# EasyEDA Pro project devboard.epro, board RCKid
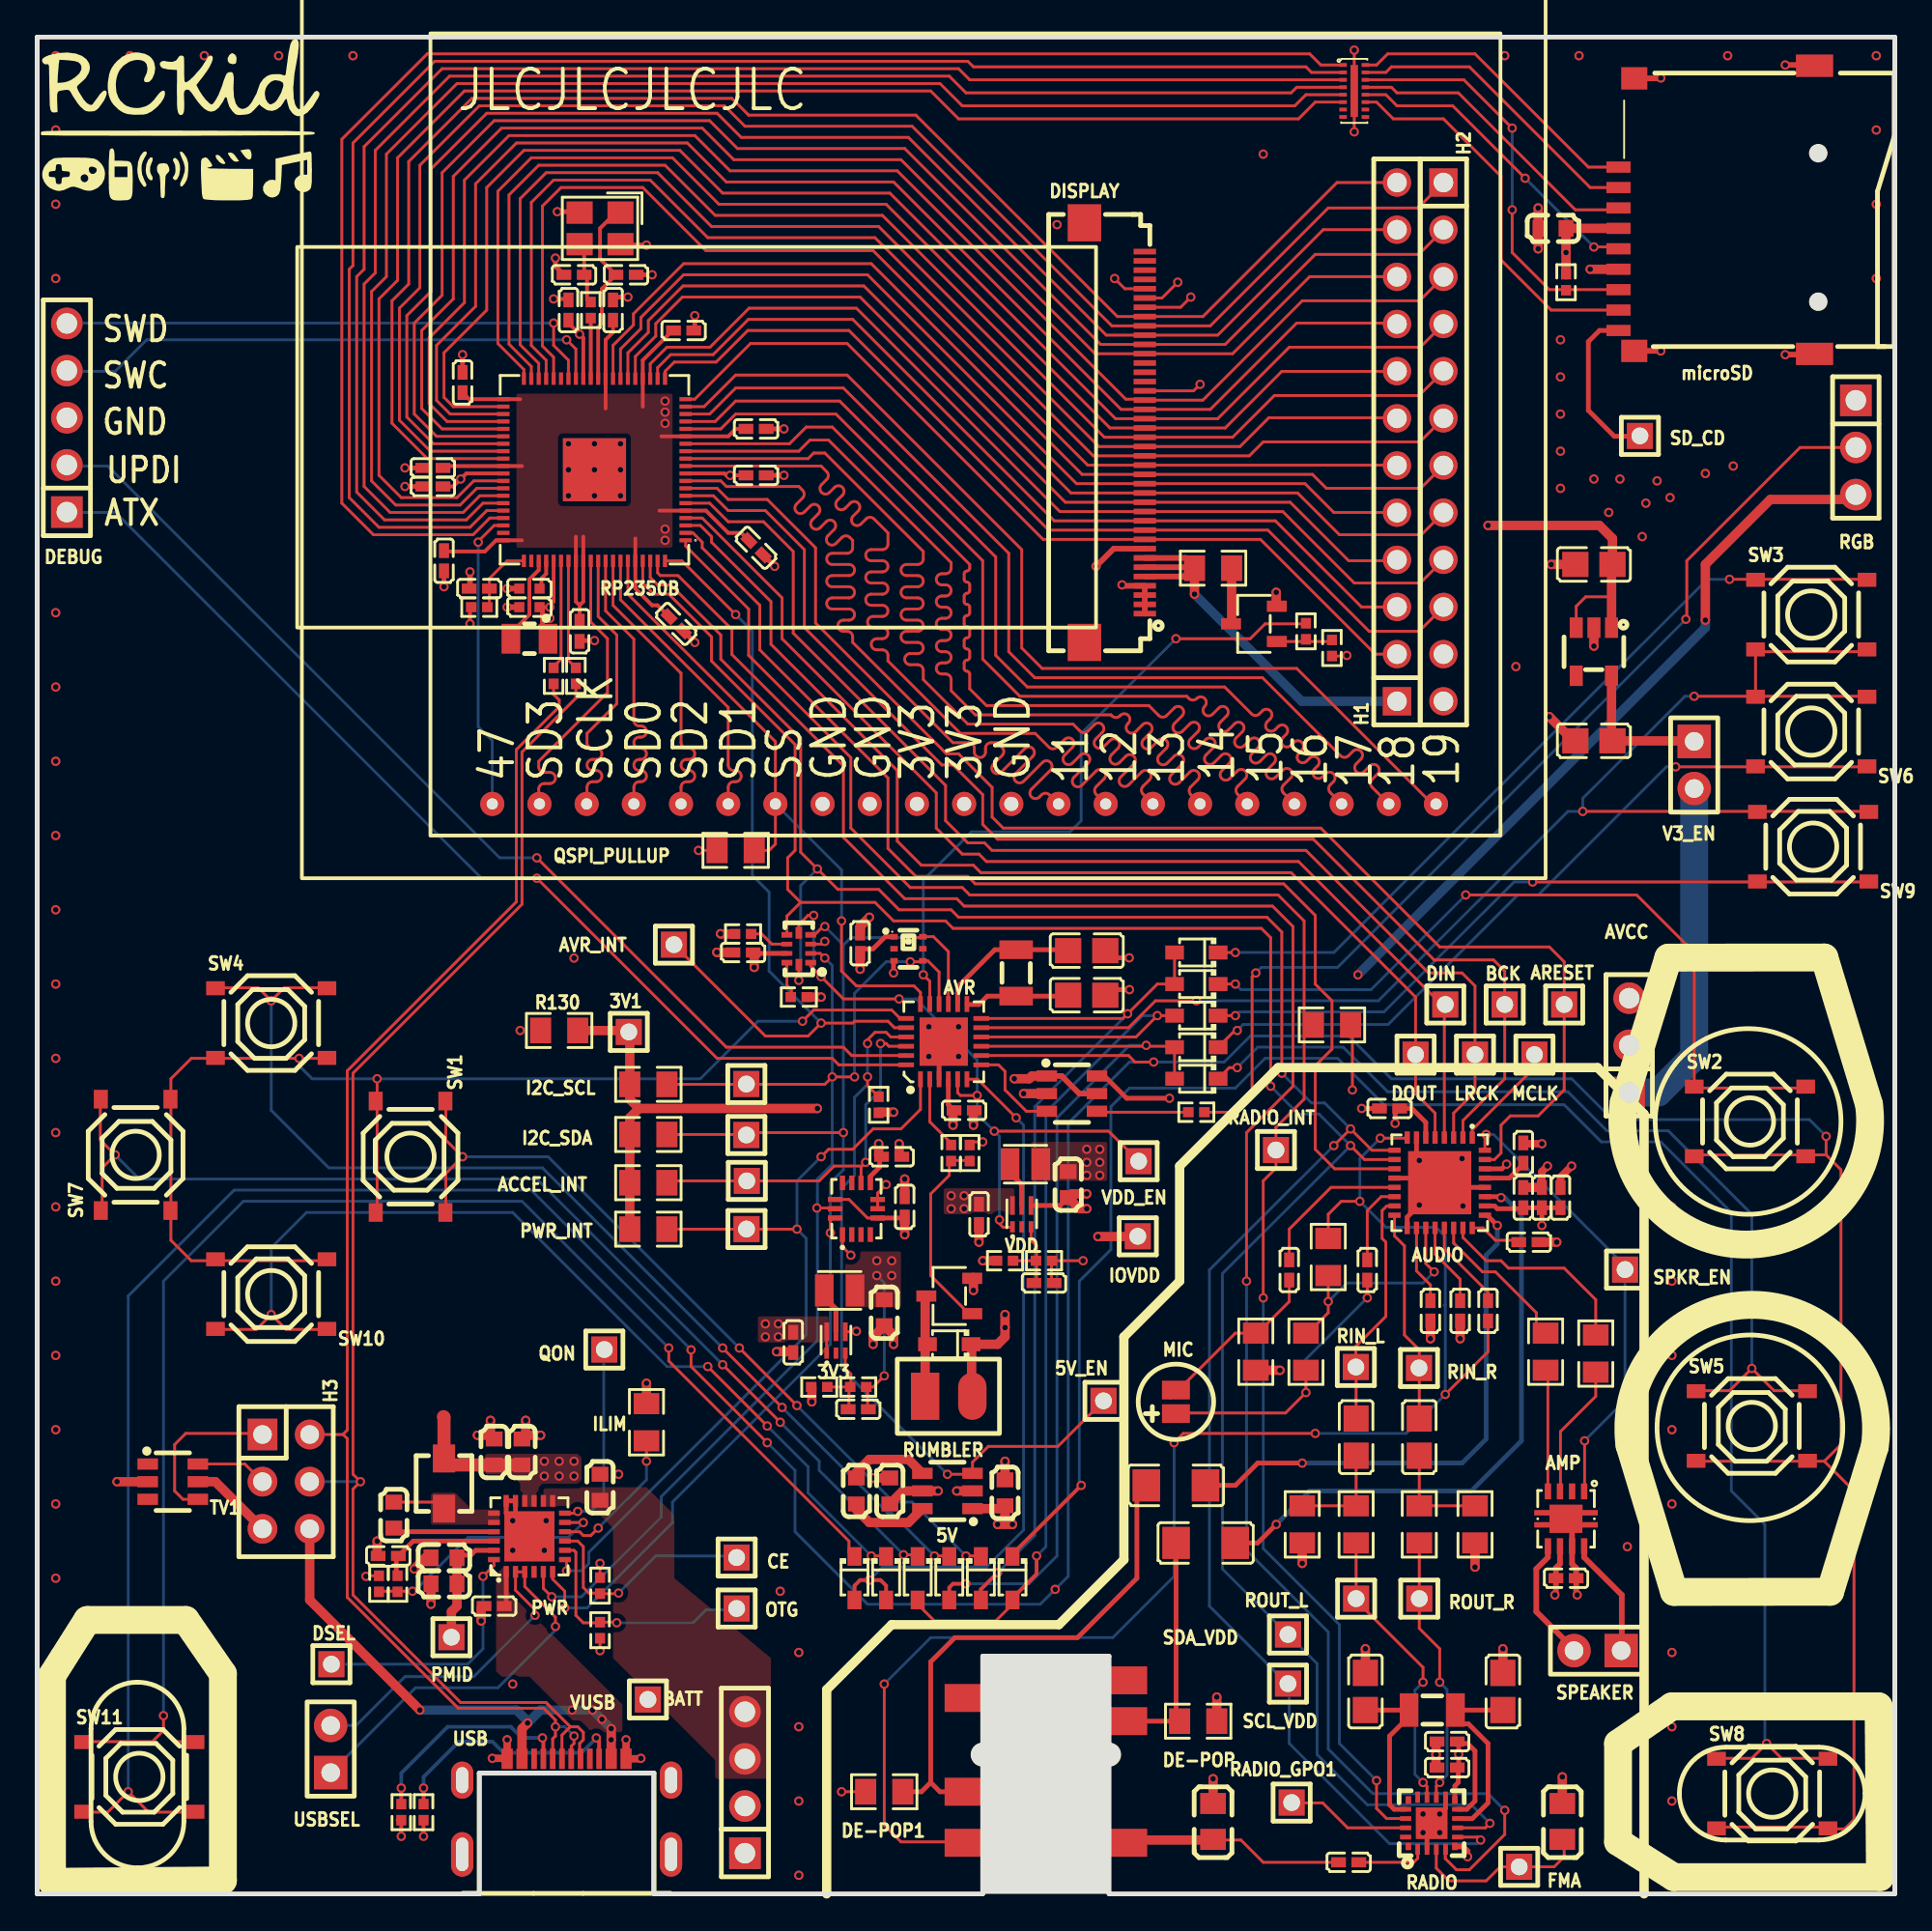
[diagram p23: board, top side]
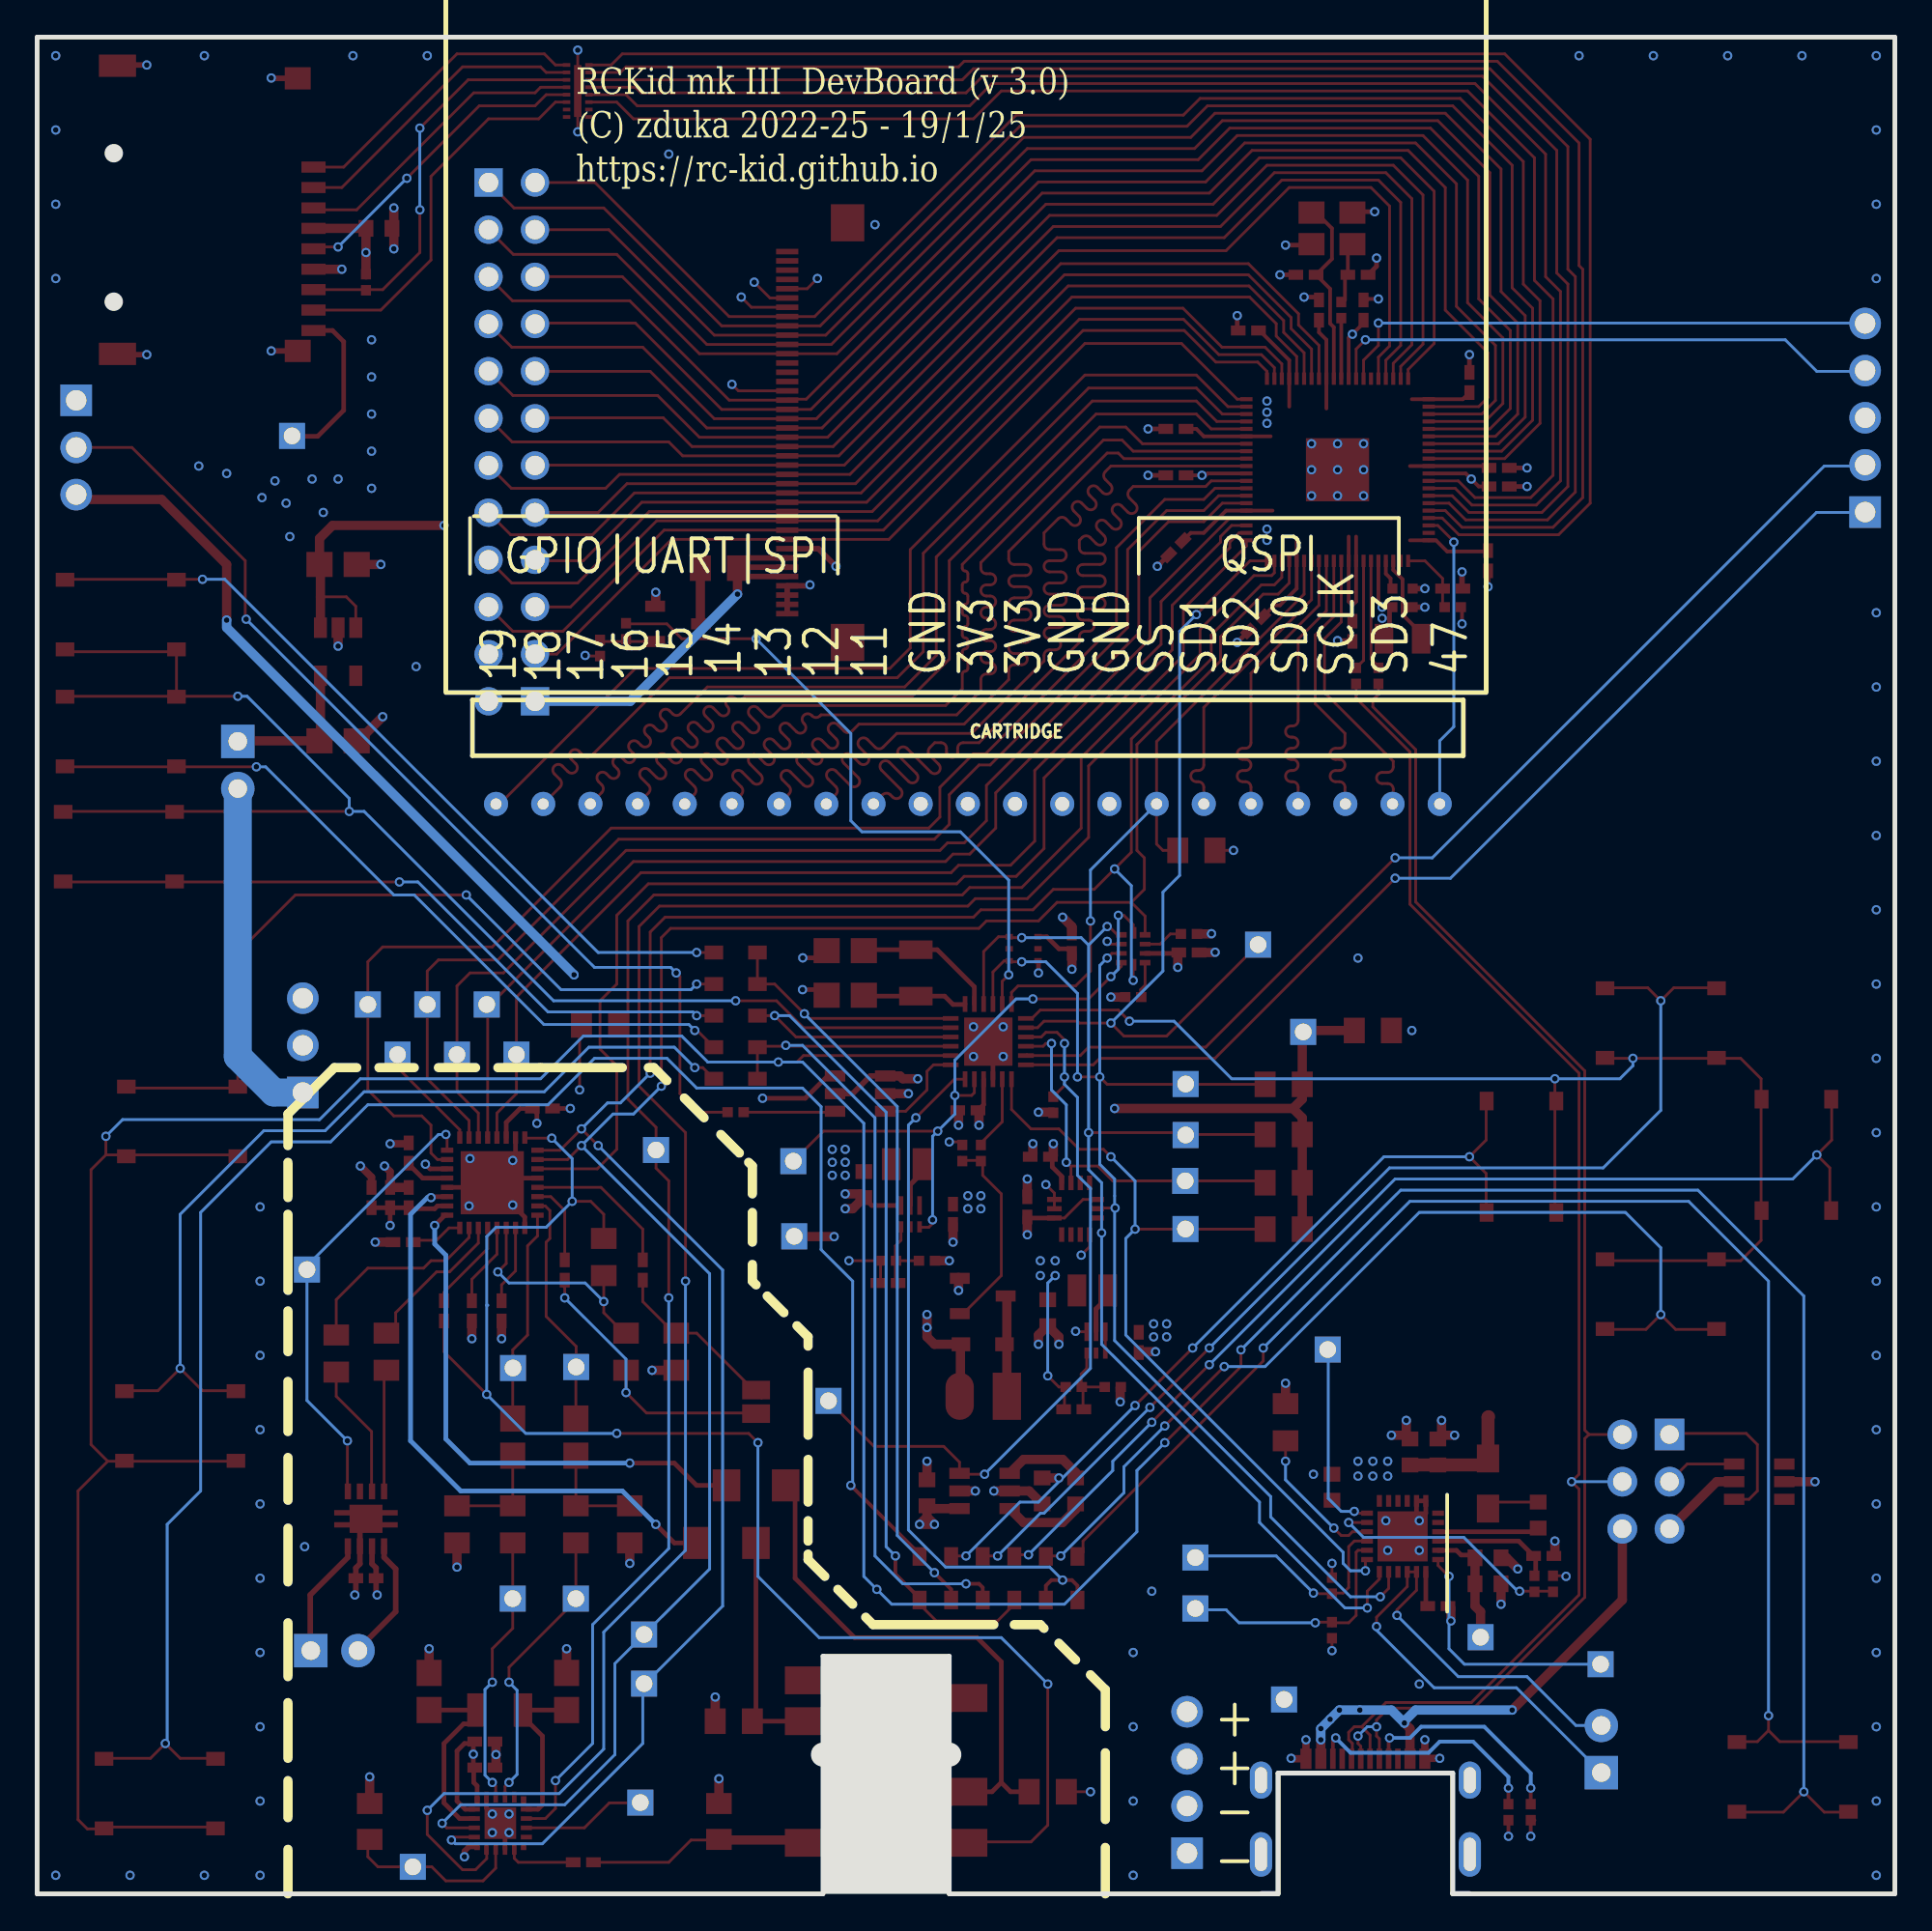
[diagram p24: board, bottom side, seen from below]

Outline 100 x 100 mm; copper layers: Top Layer, Inner1, Inner2, Bottom Layer. Coordinates in mm from the lower left corner of the outline.
Outline path: 0,100 0,0 23.8,0 23.8,6.5 33.2,6.5 33.2,0 50.9,0 50.9,12.8 57.7,12.8 57.7,0 100,0 100,100 0,100
Stack: Top Layer 0.035mm / Dielectric1 0.28mm PP er 4.5 / Inner1 0.035mm / Dielectric2 0.28mm FR4 er 4.5 / Inner2 0.035mm / Dielectric3 0.28mm PP er 4.5 / Bottom Layer 0.035mm

## Design rules (mm)
net USB_DM: DP1
net USB_DP: DP1
template: Custom Config
spacing copperThickness1oz (default): track to track 0.45, other pairs 0.127 to 0.3
spacing copperThickness2oz: track to track 0.203, other pairs 0.152 to 0.3
track width copperThickness1oz (default): min 0.127, default 0.254, max 2.54
track width copperThickness2oz: min 0.203, default 0.254, max 2.54
differential pair differentialPair (default): width min 0.127, default 0.254, max 2.54; gap min 0.152, default 0.152
via viaSize (default): diameter min 0.5, default 0.61, max 10; hole min 0.3, default 0.305, max 6.3
net 3V3 uses copperRegion1
net VUSB uses copperRegion1
net 5V uses copperRegion1
net VCC uses copperRegion1
net $1N63472 uses copperRegion1
net VBATT uses copperRegion1
pour e832 uses copperRegion1

## Placement (name value [footprint] x y rotation side)
3V1  -  [HDR-TH_1P-V-M_XKB_X4611WV-01I-C28D40]  31.85 46.42 0 top
3V3  TPS62825DMQT  [VSON-6_L1.5-W1.5-P0.50-TL]  43 29.7 90 top
5V  HX4002-MFC  [SOT-23-6_L2.9-W1.6-P0.95-LS2.8-BR]  49 21.7 0 top
5V_EN  -  [HDR-TH_1P-V-M_XKB_X4611WV-01I-C28D40]  57.4 26.55 0 top
ACCEL_INT  -  [HDR-TH_1P-V-M_XKB_X4611WV-01I-C28D40]  38.2 38.4 0 top
AMP  TPA2006D1DRBR  [VSON-8_L3.0-W3.0-P0.65-TL-EP]  82.3 20.2 270 top
ARESET  -  [HDR-TH_1P-V-M_XKB_X4611WV-01I-C28D40]  82.2 47.9 0 top
AUDIO  TLV320AIC3204IRHBR  [QFN-32_L5.0-W5.0-P0.50-TL-EP3.4]  75.5 38.3 270 top
AVCC  -  [HDR-TH_3P-P2.54-V-M]  85.7 45.7 90 top
AVR  ATTINY3217-MFR  [WQFN-24_L4.0-W4.0-P0.50-TL-EP2.6]  48.8 45.9 90 top
AVR_INT  -  [HDR-TH_1P-V-M_XKB_X4611WV-01I-C28D40]  34.28 51.12 0 top
BATT  -  [HDR-TH_4P-P2.54-V-M]  38.1 6 90 top
BCK  -  [HDR-TH_1P-V-M_XKB_X4611WV-01I-C28D40]  79 47.9 0 top
C81  10uF  [C0603]  45.9 21.7 270 top
C82  10uF  [C0603]  52.1 21.6 270 top
C83  2.2uF  [C0603]  44.1 21.7 270 top
C95  100nF  [C0402]  46.7 37 270 top
C96  100nF  [C0402]  46 39.7 180 top
C107  100nF  [C0402]  38.7 72.5 135 top
C108  100nF  [C0402]  34.4 68.4 135 top
C109  100nF  [C0402]  34.8 84.2 180 top
C110  100nF  [C0402]  21.3 76.8 0 top
C111  100nF  [C0402]  22.9 81.4 270 top
C112  100nF  [C0402]  38.7 78.9 180 top
C114  100nF  [C0402]  21.3 75.8 0 top
C115  1uF  [C0402]  38.7 76.4 180 top
C116  1uF  [C0402]  21.9 71.8 90 top
C117  100nF  [C0402]  31 85.3 270 top
C118  100nF  [C0402]  49.9 42.2 180 top
C132  22uF  [C0603]  81.6 89.7 0 top
C153  15pF  [C0402]  31.7 87.2 0 top
C154  15pF  [C0402]  28.9 87.2 180 top
C167  100nF  [C0402]  29.2 68 90 top
C191  100nF  [C0402]  80 37.5 270 top
C192  1uF  [C0402]  81 37.5 270 top
C199  47uF  [C1206]  61.3 22 0 top
C200  47uF  [C1206]  62.9 18.9 0 top
C201  10uF  [C0402]  75 31.4 270 top
C202  10uF  [C0402]  80.3 35.1 0 top
C203  10uF  [C0402]  80 39.9 90 top
C204  10uF  [C0402]  82 37.5 90 top
C205  100nF  [C0402]  71.6 33.6 270 top
C206  100nF  [C0402]  67.4 33.6 270 top
C207  100nF  [C0402]  78.1 31.4 270 top
C208  1uF  [C0402]  82.3 17 180 top
C209  1uF  [C0402]  72.8 42.3 0 top
C210  4.7uF  [C0402]  28.6 85.3 270 top
C211  4.7uF  [C0402#2]  26.5 70.3 0 top
C212  4.7uF  [C0402#2]  26.5 69.3 0 top
C213  4.7uF  [C0402]  23.8 70.3 180 top
C214  4.7uF  [C0402]  18.9 18.2 0 top
C215  22uF  [C0603]  21.9 18.1 0 top
C216  22uF  [C0603]  21.9 16.7 0 top
C218  1uF  [C0402]  24.6 15.5 0 top
C219  10uF  [C0603]  24.6 23.8 270 top
C220  10uF  [C0603]  26.1 23.8 270 top
C221  10uF  [C0603]  30.3 21.9 270 top
C224  4.7uF  [C0402]  40.7 29.7 90 top
C225  4.7uF  [C0402]  50.7 36.6 90 top
C228  22uF  [C0603]  45.6 31.3 90 top
C229  22uF  [C0603]  55.5 38.2 90 top
C230  120pF  [C0402]  44.2 26.1 0 top
C231  120pF  [C0402]  54.2 32.9 0 top
C232  22pF  [C0805]  56.5 48.4 180 top
C233  22pF  [C0805]  56.5 50.8 180 top
C234  100nF  [C0402]  38 50.7 0 top
C235  100nF  [C0402]  44.3 51.2 270 top
C236  22nF  [C0402]  75.9 6.8 0 top
C237  100nF  [C0402]  75.9 8.2 180 top
C238  22pF  [C0805]  78.9 10.9 90 top
C239  22pF  [C0805]  71.5 10.9 270 top
C240  470nF  [C0805]  71 24.6 90 top
C241  470nF  [C0805]  74.4 24.6 90 top
C242  100pF  [C0402]  70.6 1.7 0 top
C243  47nF  [C0603]  19.2 20.4 90 top
C244  100nF  [C0402]  76.6 31.4 90 top
C245  1uF  [C0805]  83.8 71.6 0 top
C246  1uF  [C0805]  83.8 62.1 0 top
CARTRIDGE  RCKid2 Cartridge Connector Female  [RCKID2 CARTRIDGE FEMALE]  49.9 58.7 180 bottom
CE  -  [HDR-TH_1P-V-M_XKB_X4611WV-01I-C28D40]  37.65 18.11 0 top
D4  1N5819WS  [SOD-323_L1.8-W1.3-LS2.5-RD]  49.1 29.6 180 top
D5  1N5819WS  [SOD-323_L1.8-W1.3-LS2.5-RD]  50.8 17 270 top
D6  1N5819WS  [SOD-323_L1.8-W1.3-LS2.5-RD]  49.1 17 270 top
D7  1N5819WS  [SOD-323_L1.8-W1.3-LS2.5-RD]  47.4 17 270 top
D8  1N5819WS  [SOD-323_L1.8-W1.3-LS2.5-RD]  45.7 17 270 top
D9  1N5819WS  [SOD-323_L1.8-W1.3-LS2.5-RD]  62.4 49 180 top
D10  1N5819WS  [SOD-323_L1.8-W1.3-LS2.5-RD]  62.4 43.9 180 top
D11  1N5819WS  [SOD-323_L1.8-W1.3-LS2.5-RD]  52.5 17 270 top
D12  1N5819WS  [SOD-323_L1.8-W1.3-LS2.5-RD]  44 17 270 top
D14  1N5819WS  [SOD-323_L1.8-W1.3-LS2.5-RD]  62.4 45.6 180 top
D15  1N5819WS  [SOD-323_L1.8-W1.3-LS2.5-RD]  62.4 47.3 180 top
D17  1N5819WS  [SOD-323_L1.8-W1.3-LS2.5-RD]  62.4 50.7 180 top
DE-POP  100kΩ  [R0805]  62.5 9.3 180 top
DE-POP1  100kΩ  [R0805]  45.6 5.5 0 top
DEBUG  -  [HDR-TH_5P-P2.54-V-M]  1.6 79.5 90 top
DIN  -  [HDR-TH_1P-V-M_XKB_X4611WV-01I-C28D40]  75.8 47.9 0 top
DISPLAY  FPC-05FB-40PH20  [FPC-SMD_40P-P0.50_XUNPU_FPC-05FB-40PH20]  58 78.7 270 top
DOUT  -  [HDR-TH_1P-V-M_XKB_X4611WV-01I-C28D40]  74.2 45.2 0 top
DSEL  -  [HDR-TH_1P-V-M_XKB_X4611WV-01I-C28D40]  15.84 12.37 0 top
FMA  -  [HDR-TH_1P-V-M_XKB_X4611WV-01I-C28D40]  79.78 1.45 0 top
H1  -  [HDR-TH_12P-P2.54-V-M]  73.2 78.2 90 top
H2  -  [HDR-TH_12P-P2.54-V-M]  75.7 78.2 270 top
H3  -  [HDR-TH_6P-P2.54-V-F-R2-C3-S2.54]  13.4 22.2 270 top
HEADSET  PJ-342D  [AUDIO-SMD_PJ-342D]  54.3 0 90 top
I2C_SCL  -  [HDR-TH_1P-V-M_XKB_X4611WV-01I-C28D40]  38.18 43.62 0 top
I2C_SDA  -  [HDR-TH_1P-V-M_XKB_X4611WV-01I-C28D40]  38.18 40.87 0 top
ILIM  270Ω  [R0805]  32.8 25.4 90 top
IOVDD  -  [HDR-TH_1P-V-M_XKB_X4611WV-01I-C28D40]  59.25 35.41 0 top
L15  IP4252CZ16-8-TTL,1  [UDFN-16_L3.3-W1.4-P0.40-BL-EP]  70.9 97.1 270 top
L16  AOTA-B201610S3R3-101-T  [IND-SMD_L2.0-W1.6_AOTA-B201610S3R3-101-T]  26.5 67.6 0 top
L17  2.2uH  [IND-SMD_L3.0-W3.0_IHLP-1212BZ]  21.9 22.1 90 top
L18  270nH  [L0805]  63.3 3.9 90 top
L19  120nH  [L0805]  82.1 3.9 90 top
LRCK  -  [HDR-TH_1P-V-M_XKB_X4611WV-01I-C28D40]  77.4 45.2 0 top
MCLK  -  [HDR-TH_1P-V-M_XKB_X4611WV-01I-C28D40]  80.6 45.2 0 top
MIC  GMI4015-2C-56db  [MIC-SMD_BD4.0_GMI4015-2C-32DB]  61.3 26.5 90 top
microSD  TF-01A  [TF-SMD_TF-01A]  90.4 90.7 90 top
OTG  -  [HDR-TH_1P-V-M_XKB_X4611WV-01I-C28D40]  37.65 15.37 0 top
PMID  -  [HDR-TH_1P-V-M_XKB_X4611WV-01I-C28D40]  22.3 13.82 0 top
PWR  -  [QFN-24_L4.0-W4.0-P0.50-TL-EP2.7]  26.5 19.25 90 top
PWR_INT  -  [HDR-TH_1P-V-M_XKB_X4611WV-01I-C28D40]  38.19 35.81 0 top
Q6  AO3400A  [SOT-23-3_L2.9-W1.6-P1.90-LS2.8-BR]  65.5 68.4 0 top
Q9  AO3400A  [SOT-23-3_L2.9-W1.6-P1.90-LS2.8-BR]  49.1 32.2 0 top
QON  -  [HDR-TH_1P-V-M_XKB_X4611WV-01I-C28D40]  30.53 29.32 0 top
QSPI_PULLUP  10kΩ  [R0805]  37.6 56.2 180 top
R45  2.2kΩ  [R0805]  32.9 43.6 180 top
R46  2.2kΩ  [R0805]  32.9 40.9 180 top
R48  10kΩ  [R0402]  45.3 42.5 270 top
R50  22Ω  [R0402]  27.8 65.6 90 top
R51  22Ω  [R0402]  29 65.6 90 top
R54  10kΩ  [R0402]  50.2 39.9 90 top
R55  10kΩ  [R0402]  69.7 67.1 270 top
R57  5.1kΩ  [R0402]  20.8 4.4 270 top
R58  5.1kΩ  [R0402]  19.6 4.4 270 top
R76  10kΩ  [R0402]  82.3 86.8 270 top
R84  5.1Ω  [R0805]  63.3 71.4 0 top
R87  470Ω  [R0402]  62.4 42.1 0 top
R91  1kΩ  [R0402]  49.2 39.9 90 top
R92  1kΩ  [R0402]  68.3 68 90 top
R93  1kΩ  [R0402]  29.8 85.3 90 top
R103  1kΩ  [R0805]  68.3 29.2 90 top
R104  1kΩ  [R0805]  65.6 29.2 90 top
R105  220kΩ  [R0805]  81.2 29.2 270 top
R106  220kΩ  [R0805]  83.9 29.1 270 top
R109  33Ω  [R0402]  23.8 69.3 0 top
R110  10kΩ  [R0402]  30.3 16.6 90 top
R111  10kΩ  [R0402]  30.3 14.2 270 top
R112  10kΩ  [R0402]  19.4 16.7 270 top
R113  10kΩ  [R0402]  18.4 16.7 90 top
R115  100kΩ  [R0402]  42.1 27.3 0 top
R116  100kΩ  [R0402]  52.1 34.1 0 top
R117  450kΩ  [R0402]  44.2 27.3 0 top
R118  450kΩ  [R0402]  54.2 34.1 0 top
R119  10kΩ  [R0402]  41 48.3 0 top
R120  10kΩ  [R0402]  38 51.7 180 top
R121  10kΩ  [R0805]  77.4 19.9 270 top
R122  10kΩ  [R0805]  68.1 19.9 270 top
R123  2.7kΩ  [R0805]  69.5 34.3 270 top
R128  10kΩ  [R0805]  32.9 35.8 180 top
R129  10kΩ  [R0805]  32.9 38.3 180 top
R130  100kΩ  [R0805]  28.1 46.5 0 top
R131  10kΩ  [R0805]  69.7 46.8 0 top
R132  0Ω  [R0805]  71 19.9 90 top
R133  0Ω  [R0805]  74.4 19.9 90 top
RADIO  SI4705-D60-GMR  [QFN-20_L3.0-W3.0-P0.50-TL-EP1.7_SILICON-LABS_SI4X55]  75.07 3.81 90 top
RADIO_GPO1  -  [HDR-TH_1P-V-M_XKB_X4611WV-01I-C28D40]  67.53 4.92 0 top
RADIO_INT  -  [HDR-TH_1P-V-M_XKB_X4611WV-01I-C28D40]  66.69 40.06 0 top
RGB  -  [HDR-TH_3P-P2.54-V-M]  97.9 77.9 270 top
RIN_L  -  [HDR-TH_1P-V-M_XKB_X4611WV-01I-C28D40]  70.99 28.38 0 top
RIN_R  -  [HDR-TH_1P-V-M_XKB_X4611WV-01I-C28D40]  74.39 28.32 0 top
ROUT_L  -  [HDR-TH_1P-V-M_XKB_X4611WV-01I-C28D40]  71 15.9 0 top
ROUT_R  -  [HDR-TH_1P-V-M_XKB_X4611WV-01I-C28D40]  74.4 15.9 0 top
RP2350B  RP2350B  [QFN-80_L10.0-W10.0-P0.40-TL-EP3.4]  30 76.7 180 top
RUMBLER  -  [SMT wire pad (2)]  47.8 26.8 90 top
SCL_VDD  -  [HDR-TH_1P-V-M_XKB_X4611WV-01I-C28D40]  67.33 11.32 0 top
SD_CD  -  [HDR-TH_1P-V-M_XKB_X4611WV-01I-C28D40]  86.28 78.52 0 top
SDA_VDD  -  [HDR-TH_1P-V-M_XKB_X4611WV-01I-C28D40]  67.33 13.97 0 top
SPEAKER  -  [HDR-TH_2P-P2.54-V-M-1]  84 13.1 180 top
SPKR_EN  -  [HDR-TH_1P-V-M_XKB_X4611WV-01I-C28D40]  85.48 33.62 0 top
SW1  TS-1187A-B-A-B  [SW-SMD_4P-L5.1-W5.1-P3.70-LS6.5-TL_H1.5]  20.1 39.7 270 top
SW2  TS-1187A-B-A-B  [SW-SMD_4P-L5.1-W5.1-P3.70-LS6.5-TL_H1.5]  92.2 41.6 0 top
SW3  TS-1187A-B-A-B  [SW-SMD_4P-L5.1-W5.1-P3.70-LS6.5-TL_H1.5]  95.5 68.9 0 top
SW4  TS-1187A-B-A-B  [SW-SMD_4P-L5.1-W5.1-P3.70-LS6.5-TL_H1.5]  12.6 46.9 0 top
SW5  TS-1187A-B-A-B  [SW-SMD_4P-L5.1-W5.1-P3.70-LS6.5-TL_H1.5]  92.3 25.2 0 top
SW6  TS-1187A-B-A-B  [SW-SMD_4P-L5.1-W5.1-P3.70-LS6.5-TL_H1.5]  95.5 62.6 180 top
SW7  TS-1187A-B-A-B  [SW-SMD_4P-L5.1-W5.1-P3.70-LS6.5-TL_H1.5]  5.3 39.8 90 top
SW8  TS-1187A-B-A-B  [SW-SMD_4P-L5.1-W5.1-P3.70-LS6.5-TL_H1.5]  93.4 5.4 0 top
SW9  TS-1187A-B-A-B  [SW-SMD_4P-L5.1-W5.1-P3.70-LS6.5-TL_H1.5]  95.6 56.4 180 top
SW10  TS-1187A-B-A-B  [SW-SMD_4P-L5.1-W5.1-P3.70-LS6.5-TL_H1.5]  12.6 32.3 180 top
SW11  TS-1187A-B-A-B  [SW-SMD_4P-L5.1-W5.1-P3.70-LS6.5-TL_H1.5]  5.5 6.3 0 top
TV1  SRV05-4-P-T7  [SOT-23-6_L2.9-W1.6-P0.95-LS2.8-BR]  7.3 22.2 180 top
U26  BMI160  [LGA-14_L3.0-W2.5-P0.50-BL]  44.1 36.9 0 top
U33  SN74LVC1T45DBVR  [SOT-23-6_L2.9-W1.6-P0.95-LS2.8-BR]  55.7 43.1 180 top
U39  ABM8-272-T3  [CRYSTAL-SMD_4P-L3.2-W2.5-BL]  30.3 89.7 180 top
U40  TS5A23159RSER  [UQFN-10_L2.0-W1.5-P0.50-BL-EP]  41 50.9 90 top
U41  LTR-390UV-01  [SENSOR-SMD_LTR-390UV-01]  46.9 50.9 270 top
U42  -  [TSOT-23-5_L2.9-W1.6-P0.95-LS2.8-BR]  83.8 66.9 90 top
USB  TYPE-C-F02C-1BBWC1.6  [USB-C-SMD_TYPE-C-F02C-1BBWC1.6]  28.5 4.7 0 top
USB1  470nH  [IND-SMD_L2.0-W1.6]  43.2 32.5 180 top
USB2  470nH  [IND-SMD_L2.0-W1.6]  53.2 39.3 180 top
USBSEL  -  [HDR-TH_2P-P2.54-V-M-1]  15.8 7.8 90 top
V3_EN  -  [HDR-TH_2P-P2.54-V-M-1]  89.2 60.8 270 top
VDD  TPS62825DMQT  [VSON-6_L1.5-W1.5-P0.50-TL]  53 36.5 90 top
VDD_EN  -  [HDR-TH_1P-V-M_XKB_X4611WV-01I-C28D40]  59.29 39.46 0 top
VUSB  -  [HDR-TH_1P-V-M_XKB_X4611WV-01I-C28D40]  32.88 10.47 0 top
X1  32.768kHz  [FC-135R_L3.2-W1.5]  52.7 49.6 90 top
X2  32.768kHz  [FC-135R_L3.2-W1.5]  75.1 9.9 180 top

## Footprints (pads in the part's own frame, mm; a bottom-side part is the same pattern mirrored in y, then rotated)
AUDIO-SMD_PJ-342D
  rect 1.5x2 smd: 1(2.75,-4.45) 2(2.75,4.45) 3(9.3,-4.45) 4(5.5,4.45) 5(10.55,4.45) 6(11.5,-4.45)
C0402
  rect 0.79x0.54 smd: 1(-0.545,0) 2(0.545,0)
C0402#2
  rect 0.54x0.54 smd: 1(-0.545,0) 2(0.545,0)
C0603
  rect 0.8x0.9 smd: 1(-0.7,0) 2(0.7,0)
C0805
  rect 1.41x1.35 smd: 1(-1,0) 2(1,0)
C1206
  rect 1.485x1.728 smd: 1(-1.593,0) 2(1.593,0)
CRYSTAL-SMD_4P-L3.2-W2.5-BL
  rect 1.4x1.2 smd: 1(-1.1,-0.85) 2(1.1,-0.85) 3(1.1,0.85) 4(-1.1,0.85)
FC-135R_L3.2-W1.5
  rect 1x1.8 smd: 1(-1.25,0) 2(1.25,0)
FPC-SMD_40P-P0.50_XUNPU_FPC-05FB-40PH20
  rect 0.3x1.2 smd: 1(9.75,1.625) 2(9.25,1.625) 3(8.75,1.625) 4(8.25,1.625) 5(7.75,1.625) 6(7.25,1.625) 7(6.75,1.625) 8(6.25,1.625) 9(5.75,1.625) 10(5.25,1.625) 11(4.75,1.625) 12(4.25,1.625) 13(3.75,1.625) 14(3.25,1.625) 15(2.75,1.625) 16(2.25,1.625) 17(1.75,1.625) 18(1.25,1.625) 19(0.75,1.625) 20(0.25,1.625) 21(-0.25,1.625) 22(-0.75,1.625) 23(-1.25,1.625) 24(-1.75,1.625) 25(-2.25,1.625) 26(-2.75,1.625) 27(-3.25,1.625) 28(-3.75,1.625) 29(-4.25,1.625) 30(-4.75,1.625) 31(-5.25,1.625) 32(-5.75,1.625) 33(-6.25,1.625) 34(-6.75,1.625) 35(-7.25,1.625) 36(-7.75,1.625) 37(-8.25,1.625) 38(-8.75,1.625) 39(-9.25,1.625) 40(-9.75,1.625)
  rect 2x1.8 smd: 41(-11.3,-1.625) 42(11.3,-1.625)
HDR-TH_1P-V-M_XKB_X4611WV-01I-C28D40
  rect 1.4x1.4 hole 0.9: 1(0,0)
HDR-TH_2P-P2.54-V-M-1
  rect 1.8x1.8 hole 1: 1(-1.27,0)
  round 1.8 hole 1: 2(1.27,0)
HDR-TH_3P-P2.54-V-M
  rect 1.7x1.7 hole 1.1: 1(-2.54,0)
  round 1.7 hole 1.1: 2(0,0) 3(2.54,0)
HDR-TH_4P-P2.54-V-M
  rect 1.7x1.7 hole 1.1: 1(-3.81,0)
  round 1.7 hole 1.1: 2(-1.27,0) 3(1.27,0) 4(3.81,0)
HDR-TH_5P-P2.54-V-M
  rect 1.7x1.7 hole 1.1: 1(-5.08,0)
  round 1.7 hole 1.1: 2(-2.54,0) 3(0,0) 4(2.54,0) 5(5.08,0)
HDR-TH_6P-P2.54-V-F-R2-C3-S2.54
  rect 1.7x1.6 hole 1: 1(-2.54,-1.27)
  round 1.6 hole 1: 2(-2.54,1.27) 3(0,-1.27) 4(0,1.27) 5(2.54,-1.27) 6(2.54,1.27)
HDR-TH_12P-P2.54-V-M
  rect 1.524x1.524 hole 1.05: 1(-13.97,0)
  round 1.524 hole 1.05: 2(-11.43,0) 3(-8.89,0) 4(-6.35,0) 5(-3.81,0) 6(-1.27,0) 7(1.27,0) 8(3.81,0) 9(6.35,0) 10(8.89,0) 11(11.43,0) 12(13.97,0)
IND-SMD_L2.0-W1.6
  rect 1x1.72 smd: 1(0.828,0) 2(-0.828,0)
IND-SMD_L2.0-W1.6_AOTA-B201610S3R3-101-T
  rect 1x1.6 smd: 1(-1,0) 2(1,0)
IND-SMD_L3.0-W3.0_IHLP-1212BZ
  rect 1.5x1.2 smd: 1(-1.35,0) 2(1.35,0)
L0805
  rect 1.133x1.377 smd: 1(-0.966,0) 2(0.966,0)
LGA-14_L3.0-W2.5-P0.50-BL
  rect 0.28x0.785 smd: 1(-0.75,-1.393) 2(-0.25,-1.393) 3(0.25,-1.393) 4(0.75,-1.393) 8(0.75,1.393) 9(0.25,1.393) 10(-0.25,1.393) 11(-0.75,1.393)
  rect 0.785x0.28 smd: 5(1.143,-0.5) 6(1.143,0) 7(1.143,0.5) 12(-1.143,0.5) 13(-1.143,0) 14(-1.143,-0.5)
MIC-SMD_BD4.0_GMI4015-2C-32DB
  rect 1x1.5 smd: 1(-0.635,0) 2(0.635,0)
QFN-20_L3.0-W3.0-P0.50-TL-EP1.7_SILICON-LABS_SI4X55
  rect 0.4x0.3 smd: 1(-1.25,1.25) 6(-1.25,-1.25) 11(1.25,-1.25) 16(1.25,1.25)
  rect 0.6x0.25 smd: 2(-1.4,0.75) 3(-1.4,0.25) 4(-1.4,-0.25) 5(-1.4,-0.75) 12(1.4,-0.75) 13(1.4,-0.25) 14(1.4,0.25) 15(1.4,0.75)
  rect 0.25x0.6 smd: 7(-0.75,-1.4) 8(-0.25,-1.4) 9(0.25,-1.4) 10(0.75,-1.4) 17(0.75,1.4) 18(0.25,1.4) 19(-0.25,1.4) 20(-0.75,1.4)
  rect 1.7x1.7 smd: 21(0,0)
QFN-24_L4.0-W4.0-P0.50-TL-EP2.7
  rect 0.633x0.28 smd: 1(-1.911,1.25) 2(-1.911,0.75) 3(-1.911,0.25) 4(-1.911,-0.25) 5(-1.911,-0.75) 6(-1.911,-1.25) 13(1.911,-1.25) 14(1.911,-0.75) 15(1.911,-0.25) 16(1.911,0.25) 17(1.911,0.75) 18(1.911,1.25)
  rect 0.28x0.633 smd: 7(-1.25,-1.911) 8(-0.75,-1.911) 9(-0.25,-1.911) 10(0.25,-1.911) 11(0.75,-1.911) 12(1.25,-1.911) 19(1.25,1.911) 20(0.75,1.911) 21(0.25,1.911) 22(-0.25,1.911) 23(-0.75,1.911) 24(-1.25,1.911)
  rect 2.7x2.7 smd: 25(0,0)
QFN-32_L5.0-W5.0-P0.50-TL-EP3.4
  rect 0.665x0.28 smd: 1(-2.433,1.75) 2(-2.433,1.25) 3(-2.433,0.75) 4(-2.433,0.25) 5(-2.433,-0.25) 6(-2.433,-0.75) 7(-2.433,-1.25) 8(-2.433,-1.75) 17(2.433,-1.75) 18(2.433,-1.25) 19(2.433,-0.75) 20(2.433,-0.25) 21(2.433,0.25) 22(2.433,0.75) 23(2.433,1.25) 24(2.433,1.75)
  rect 0.28x0.665 smd: 9(-1.75,-2.433) 10(-1.25,-2.433) 11(-0.75,-2.433) 12(-0.25,-2.433) 13(0.25,-2.433) 14(0.75,-2.433) 15(1.25,-2.433) 16(1.75,-2.433) 25(1.75,2.433) 26(1.25,2.433) 27(0.75,2.433) 28(0.25,2.433) 29(-0.25,2.433) 30(-0.75,2.433) 31(-1.25,2.433) 32(-1.75,2.433)
  rect 3.4x3.4 smd: 33(0,0)
QFN-80_L10.0-W10.0-P0.40-TL-EP3.4
  rect 0.665x0.22 smd: 1(-4.907,3.8) 2(-4.907,3.4) 3(-4.907,3) 4(-4.907,2.6) 5(-4.907,2.2) 6(-4.907,1.8) 7(-4.907,1.4) 8(-4.907,1) 9(-4.907,0.6) 10(-4.907,0.2) 11(-4.907,-0.2) 12(-4.907,-0.6) 13(-4.907,-1) 14(-4.907,-1.4) 15(-4.907,-1.8) 16(-4.907,-2.2) 17(-4.907,-2.6) 18(-4.907,-3) 19(-4.907,-3.4) 20(-4.907,-3.8) 41(4.907,-3.8) 42(4.907,-3.4) 43(4.907,-3) 44(4.907,-2.6) 45(4.907,-2.2) 46(4.907,-1.8) 47(4.907,-1.4) 48(4.907,-1) 49(4.907,-0.6) 50(4.907,-0.2) 51(4.907,0.2) 52(4.907,0.6) 53(4.907,1) 54(4.907,1.4) 55(4.907,1.8) 56(4.907,2.2) 57(4.907,2.6) 58(4.907,3) 59(4.907,3.4) 60(4.907,3.8)
  rect 0.22x0.665 smd: 21(-3.8,-4.907) 22(-3.4,-4.907) 23(-3,-4.907) 24(-2.6,-4.907) 25(-2.2,-4.907) 26(-1.8,-4.907) 27(-1.4,-4.907) 28(-1,-4.907) 29(-0.6,-4.907) 30(-0.2,-4.907) 31(0.2,-4.907) 32(0.6,-4.907) 33(1,-4.907) 34(1.4,-4.907) 35(1.8,-4.907) 36(2.2,-4.907) 37(2.6,-4.907) 38(3,-4.907) 39(3.4,-4.907) 40(3.8,-4.907) 61(3.8,4.907) 62(3.4,4.907) 63(3,4.907) 64(2.6,4.907) 65(2.2,4.907) 66(1.8,4.907) 67(1.4,4.907) 68(1,4.907) 69(0.6,4.907) 70(0.2,4.907) 71(-0.2,4.907) 72(-0.6,4.907) 73(-1,4.907) 74(-1.4,4.907) 75(-1.8,4.907) 76(-2.2,4.907) 77(-2.6,4.907) 78(-3,4.907) 79(-3.4,4.907) 80(-3.8,4.907)
  rect 3.4x3.4 smd: 81(0,0)
R0402
  rect 0.566x0.54 smd: 1(-0.433,0) 2(0.433,0)
R0805
  rect 1.133x1.377 smd: 1(-1,0) 2(1,0)
RCKID2 CARTRIDGE FEMALE
  round 1.3 hole 0.6: 1(-25.4,0) 2(-22.86,0) 3(-20.32,0.003) 4(-17.78,0.003) 5(-15.24,0.003) 6(-12.7,0.003) 7(-10.16,0.003) 8(-7.62,0.003) 9(-5.08,0.003) 15(10.16,0.003) 16(12.7,0.003) 17(15.24,0.003) 18(17.78,0.003) 19(20.32,0.003) 20(22.86,0.003) 21(25.4,0.003)
  round 1.3 hole 0.762x0.6: 10(-2.54,0.003) 11(0,0.003) 12(2.54,0.003) 13(5.08,0.003) 14(7.62,0.003)
SENSOR-SMD_LTR-390UV-01
  rect 0.3x0.4 smd: 1(-0.65,-0.775) 2(0,-0.775) 3(0.65,-0.775) 4(0.65,0.775) 5(0,0.775) 6(-0.65,0.775)
SMT wire pad (2)
  rect 2.54x1.524 smd: 1(0,0)
  rrect 2.54x1.524 smd: 2(0,-2.54)
SOD-323_L1.8-W1.3-LS2.5-RD
  rect 1x0.75 smd: 1(-1.173,0) 2(1.173,0)
SOT-23-3_L2.9-W1.6-P1.90-LS2.8-BR
  rect 1.07x0.6 smd: 1(1.235,-0.95) 2(1.235,0.95) 3(-1.235,0)
SOT-23-6_L2.9-W1.6-P0.95-LS2.8-BR
  rect 1.1x0.6 smd: 1(1.35,-0.95) 2(1.35,0) 3(1.35,0.95) 4(-1.35,0.95) 5(-1.35,0) 6(-1.35,-0.95)
SW-SMD_4P-L5.1-W5.1-P3.70-LS6.5-TL_H1.5
  rect 1x0.75 smd: 1(-3,1.875) 2(3,1.875) 3(-3,-1.875) 4(3,-1.875)
TF-SMD_TF-01A
  rect 0.6x1.3 smd: 1(2.3,5.276) 2(1.2,5.276) 3(0.101,5.276) 4(-1,5.276) 5(-2.099,5.276) 6(-3.2,5.276) 7(-4.3,5.276) 8(-5.399,5.276) 9(-6.5,5.276)
  rect 1.2x1.4 smd: 10(-7.599,4.426) 13(7.08,4.426)
  rect 1.2x2 smd: 11(-7.76,-5.276) 12(7.76,-5.276)
TSOT-23-5_L2.9-W1.6-P0.95-LS2.8-BR
  rect 1.1x0.7 smd: 1(1.294,-0.951) 2(1.294,-0.001) 3(1.294,0.951) 4(-1.294,0.951) 5(-1.294,-0.949)
UDFN-16_L3.3-W1.4-P0.40-BL-EP
  rect 0.2x0.4 smd: 1(-1.4,-0.6) 2(-1,-0.6) 3(-0.6,-0.6) 4(-0.2,-0.6) 5(0.2,-0.6) 6(0.6,-0.6) 7(1,-0.6) 8(1.4,-0.6) 9(1.4,0.6) 10(1,0.6) 11(0.6,0.6) 12(0.2,0.6) 13(-0.2,0.6) 14(-0.6,0.6) 15(-1,0.6) 16(-1.4,0.6)
  rect 2.8x0.4 smd: 17(0,0)
UQFN-10_L2.0-W1.5-P0.50-BL-EP
  rect 0.3x0.58 smd: 1(-0.748,-0.64) 4(0.752,-0.64) 6(0.752,0.64) 9(-0.748,0.64)
  rect 0.25x0.58 smd: 2(-0.248,-0.64) 3(0.252,-0.64) 7(0.252,0.64) 8(-0.248,0.64)
  rect 0.63x0.35 smd: 5(0.86,0) 10(-0.86,-0.002)
USB-C-SMD_TYPE-C-F02C-1BBWC1.6
  oval 1.2x2 hole 0.65x1.4: 13(5.62,1.425) 16(-5.62,1.425)
  oval 1.2x2.4 hole 0.65x1.8: 14(5.62,-2.575) 15(-5.62,-2.575)
  rect 0.3x1.1 smd: A5(-1.25,2.575) A6(-0.25,2.575) A7(0.25,2.575) A8(1.25,2.575) B5(1.75,2.575) B6(0.75,2.575) B7(-0.75,2.575) B8(-1.75,2.575)
  rect 0.6x1.1 smd: A9B4(2.4,2.575) A12B1(3.2,2.575) B9A4(-2.4,2.575) B12A1(-3.2,2.575)
VSON-6_L1.5-W1.5-P0.50-TL
  rect 0.6x0.25 smd: 1(-0.575,0.5) 2(-0.575,0) 3(-0.575,-0.5)
  rect 1x0.25 smd: 4(0.575,-0.5) 5(0.575,0) 6(0.575,0.5)
VSON-8_L3.0-W3.0-P0.65-TL-EP
  rect 0.85x0.34 smd: 1(-1.476,0.975) 2(-1.476,0.325) 3(-1.476,-0.325) 4(-1.476,-0.976) 5(1.476,-0.976) 6(1.476,-0.325) 7(1.476,0.325) 8(1.476,0.976)
  custom 1.52x3.42 smd: 9(0,-0.005)
WQFN-24_L4.0-W4.0-P0.50-TL-EP2.6
  rect 0.85x0.25 smd: 1(-2.025,1.25) 2(-2.025,0.75) 3(-2.025,0.25) 4(-2.025,-0.25) 5(-2.025,-0.75) 6(-2.025,-1.25) 13(2.025,-1.25) 14(2.025,-0.75) 15(2.025,-0.25) 16(2.025,0.25) 17(2.025,0.75) 18(2.025,1.25)
  rect 0.25x0.85 smd: 7(-1.25,-2.025) 8(-0.75,-2.025) 9(-0.25,-2.025) 10(0.25,-2.025) 11(0.75,-2.025) 12(1.25,-2.025) 19(1.25,2.025) 20(0.75,2.025) 21(0.25,2.025) 22(-0.25,2.025) 23(-0.75,2.025) 24(-1.25,2.025)
  rect 2.6x2.6 smd: 25(0.001,0)

## Nets
As in the schematic.

Pads without a net: 3V3 2; AMP 2; AUDIO 33; DISPLAY 26 27 28 37 38 39 40 41 42; HEADSET 5 6; L15 7 8 9 10; PWR 4; RADIO 1 15 16 20 21; RP2350B 35 59; TV1 1 3; U26 4 10 11; U41 2 5; U42 4; USB 13 14 15 16 A8 B8; VDD 2

## Via types
v1: diameter 0.5, hole 0.3, Top Layer to Bottom Layer, 415 vias

## Routing (per net, layer and track width the routed paths; a pad name or vN(x,y) marks a point on that pad's centre or on a via; arc(x,y) is an arc through that point)
3V3: length 52
  Top Layer w0.15: U26.12 43.7,37.4 44.7,36.4 U26.5 ; 44.7,26.1 44.7,27.3 45,27.3 v1(45.6,27.9)
  Top Layer w0.25: AVR.4 49.05,42.5 C118.2 ; 45.35,39.7 45.35,39.15 44.85,38.65 U26.8 ; U26.5 46.65,36.4 C95.2 ; C235.2 44.54,50.9 45,50.9 45.65,51.55 U41.1 ; U40.8 38.59,50.65
  Top Layer w0.3: U33.1 55.15,44.05 56.1,43.1 U33.5
  Top Layer w0.5: C234.2 38.6,50.64 v1(38.6,49.9) ; v1(45.3,40.4) 45.3,39.75 45.35,39.7 ; 32.4,42.3 31.9,41.8 R46.2 R129.2 R128.2 ; 32.4,42.3 v1(42,42.3) ; 32.4,42.3 31.9,42.8 R45.2 31.9,46.37 3V1.1 31.77,46.5 R130.2 ; C118.2 49.3,42.14 v1(49.3,41.4) ; U33.1 53.55,44.05 53.4,43.9 v1(52.6,43.9) ; C95.2 v1(46.7,35.5) ; C235.2 v1(44.3,49.8)
  Bottom Layer w0.15: v1(45.2,33.3) 45.6,32.9 v1(45.6,27.9)
  vias: v1(45.2,34.1) v1(46,34.1) v1(46,33.3)
5V: length 48.1
  Top Layer w0.25: U33.6 57.45,44.05 58.65,42.85 v1(60.95,42.85)
  Top Layer w0.5: 52.1,20.3 v1(51.7,19.9) v1(52.5,19.9) 52.1,20.3 ; 52.1,20.3 C82.2 51.95,20.75 5V.1 ; 97.9,75.1 93.3,75.1 89.8,71.6 v1(89.8,68.6)
  Bottom Layer w0.5: v1(71.1,49.5) 89.8,68.2 v1(89.8,68.6)
5V_ON: length 40.4
  Top Layer w0.15: R48.1 44.7,43.53 v1(44.7,44) ; v1(44.7,45.8) 44.7,46 45.1,46.4 45.7,46.4 45.95,46.15 AVR.21 ; v1(49,22.6) 50.3,22.6 5V.3 50.35,23.25 51.2,24.1 54.95,24.1 5V_EN.1
  Bottom Layer w0.15: v1(49,22.6) 43.3,28.3 43.3,38 44,38.7 44,42.9 44.7,43.6 v1(44.7,44) v1(44.7,45.8)
DVDD: length 15
  Top Layer w0.2: RP2350B.65 27.8,69.6 27.5,69.3 27.2,69.3 ; C115.2 v1(37.3,76.4) 37.1,76.4 37,76.5 RP2350B.10 ; RP2350B.51 23.1,76.5 v1(22.8,76.2) 22.4,75.8 C114.2 ; RP2350B.32 29.4,83.8 v1(29.2,84) 28.6,84.6 28.6,84.75
  Top Layer w0.25: L16.2 27.2,67.9 27.2,69.3
  vias: v1(27.6,69.3) v1(27.6,68.7)
GND: length 135.8
  Top Layer w0.15: v1(70.9,94.9) L15.17 v1(70.9,99.3) ; R113.2 17.73,17.13 v1(17.7,17.1) ; 3V3.4 44.07,30.27 v1(44.1,30.3) ; DISPLAY.25 62.25,80.95 v1(62.6,81.3) ; 50.3,40.53 50.33,40.5 v1(50.9,40.5) ; v1(43.8,34.4) 43.35,34.85 U26.1 ; v1(42.4,51.3) 42.25,51.15 U40.3 ; U26.6 U26.7 45.24,37.74 v1(45.7,38.2) ; v1(70.5,66.7) 70.47,66.67 R55.2 ; v1(43.3,5.5) DE-POP1.1 ; DISPLAY.36 58.55,86.45 v1(58,87) ; R111.2 v1(30.3,13.1) ; v1(30.3,17.8) 30.3,17
  Top Layer w0.2: 28.4,85.84 28.34,85.9 v1(27.8,85.9) ; v1(19.6,3.1) 19.6,3.77 19.4,3.97 ; v1(20.8,3.1) R57.2
  Top Layer w0.25: v1(71.3,42.3) C209.1 ; v1(32.8,88.8) 31.45,88.8 U39.4 ; AUDIO.28 75.75,38.05 75.25,38.55 ; v1(35.4,85) 35.4,84.25 C109.1 ; RADIO.3 74.82,3.08 v1(74.6,3.3) ; v1(39.7,71.5) 39.65,71.5 39.54,71.61 39.54,71.66 C107.1 ; C167.1 29.25,67.5 v1(30,67.5) ; AUDIO.12 75.25,38.55 ; 75.25,38.55 74.25,39.55 AUDIO.7 ; v1(40.2,76.4) C115.1 ; v1(27.9,88.1) 27.9,87.65 C154.2 ; 31,85.94 31.06,86 v1(31.8,86) ; 46.1,50.2 v1(46.1,49.6) ; U39.2 29.15,90.6 v1(28,90.6) ; C232.1 57.8,48.7 v1(58.8,48.7) ; VDD.4 55.07,37.07 C229.1 ; v1(40.2,78.9) C112.1 ; v1(75.5,4.3) 75.82,4.62 75.82,5.21 ; v1(74.4,37.1) 73.75,36.45 AUDIO.17 ; AVR.3 48.55,45.65 AVR.25 ; v1(58.79,50.41) 57.89,50.41 C233.1 ; 25.75,20 25.25,20.5 PWR.18 PWR.17 25.75,20 ; 25.75,20 PWR.25 ; v1(21.9,70.4) 21.9,71.25 ; v1(33.1,87.2) C153.2 ; v1(19.8,76.8) C110.1 ; v1(19.8,75.8) C114.1 ; v1(22.9,82.9) C111.1 ; v1(35.4,67.4) C108.1
  Top Layer w0.3: v1(87.4,97.8) 87.38,97.78 microSD.13 ; v1(94.1,82.9) 95.64,82.9 microSD.11 ; v1(82.9,16.1) 82.84,16.16 C208.1 82.84,17.55 82.62,17.77 AMP.7 82.62,19.87 AMP.9 ; v1(25.3,70.3) C211.1 ; v1(58.4,70.5) 58.45,70.45 DISPLAY.4 DISPLAY.3 DISPLAY.2 DISPLAY.1 ; RADIO.6 76.74,2.56 77,2.3 v1(77,2) ; v1(87.4,83.1) microSD.10 ; v1(25.3,69.3) C212.1 ; v1(23.3,71.2) 23.3,70.34 C213.2 ; microSD.12 95.64,98.5 v1(94.1,98.5)
  Top Layer w0.4: v1(24.5,7.3) 25.28,7.3 USB.B12A1 v1(25.3,8.3) ; C203.2 80.04,40.4 v1(81,40.4) ; C204.2 82,38.6 v1(82.6,39.2) ; C192.1 81,38.9 v1(81.3,39.2) ; v1(31.7,8.3) USB.A12B1 32.47,7.27 v1(32.5,7.3)
  Top Layer w0.5: TV1.2 v1(4.3,22.2) ; v1(24.4,25.5) 24.4,24.7 ; 24.4,24.7 v1(23.7,24.7) ; 24.4,24.7 24.4,24.5 ; v1(44.8,52.6) 44.3,52.1 44.3,51.8 ; v1(27.1,24.7) 26.3,24.7 ; 26.3,24.7 26.2,24.7 ; 26.3,24.7 26.3,24.6 ; 26.3,24.7 v1(26.3,25.5) ; C246.1 82.7,62.1 v1(81.4,63.4) ; 37.5,51.7 36.8,51.7 v1(36.79,51.71) ; 37.3,50.7 36.6,50.7 v1(36.59,50.71) ; v1(80.8,90.8) 80.8,89.9 ; C81.1 v1(45,22.4) ; ILIM.2 v1(32.8,27.5) ; v1(66.9,28.2) R104.1 ; v1(23.9,14.7) 23.9,15.4 ; v1(46.4,40.4) 46.4,39.8 ; v1(77.4,17.6) R121.2 ; v1(56.5,37.7) 55.7,37.7 C229.1 56.1,36.9 v1(56.5,36.9) ; v1(81.8,35.1) C202.2 ; v1(46.7,38.5) 46.7,37.6 ; v1(46.1,42.1) 45.3,42.1 ; v1(53.1,43.1) 54.1,43.1 ; v1(50.7,35.1) 50.7,36.1 ; v1(52.1,23.3) C82.1 ; v1(42.2,48.3) 41.4,48.3 ; R115.1 41.7,27.27 v1(41.7,26.5) ; v1(21.2,15.6) 21.2,16.5 ; v1(63.5,10.6) DE-POP.1 ; v1(68.1,17.8) R122.2 ; v1(83.6,87.5) 84.9,87.5 ; 75.3,8.2 v1(75.3,7.5) 75.3,6.8 ; v1(66.7,70.1) 66.7,69.38 Q6.2 ; C118.1 50.4,42.15 v1(50.4,41.4) ; v1(83.8,67.2) 83.8,68.19 ; v1(46.1,29.6) 46.1,30.1 C228.1 45,30 v1(45,29.6) ; v1(75,29.9) C201.2 ; v1(80.8,88.6) 80.8,89.8 ; v1(81.5,71.6) C245.1 ; L19.2 v1(82.1,6.3) ; v1(39.8,29.2) 40.66,29.2 C224.1 ; C191.1 C192.1 ; v1(63.3,6.2) L18.2 ; v1(78.9,13.2) C238.2 ; 21,18.1 20.9,18.1 v1(20.3,17.5) ; v1(18.3,19) 18.3,18.3 ; v1(50.4,32.5) 50.4,33.2 ; v1(76.6,29.9) C244.1 ; v1(71.5,13.2) C239.1 ; v1(50.9,34.1) 51.6,34.1 ; v1(49.5,21.7) 5V.2
  vias: v1(1,99) v1(1,95) v1(1,91) v1(1,87) v1(1,69) v1(1,65) v1(1,61) v1(1,57) v1(1,53) v1(1,49) v1(1,45) v1(1,41) v1(1,37) v1(1,33) v1(1,29) v1(1,25) v1(1,21) v1(1,17) v1(1,13) v1(1,9) v1(1,5) v1(1,1) v1(5,99) v1(9,99) v1(13,99) v1(17,99) v1(25.6,20.1) v1(25.6,18.5) v1(25.6,11.3) v1(26,46.5) v1(27.3,18.5) v1(27.4,20.1) v1(28.6,78.1) v1(28.6,76.7) v1(28.6,75.3) v1(28.9,50.4) v1(30,78.1) v1(30,76.7) v1(30,75.3) v1(31.3,22.6) v1(31.4,78.1) v1(31.4,76.7) v1(31.4,75.3) v1(40,16.3) v1(41,13) v1(41,9) v1(41,5) v1(41,1) v1(48,46.7) v1(48,45.1) v1(49.6,46.7) v1(49.6,45.1) v1(54.9,89.9) v1(66,93.7) v1(74.4,39.5) v1(74.6,4.3) v1(75.5,3.3) v1(76.7,39.6) v1(76.75,37.05) v1(79,99) v1(79.6,66.1) v1(82,83.7) v1(82,81.7) v1(82,79.7) v1(82,77.7) v1(82,75.7) v1(83,99) v1(83.8,76.2) v1(84.6,74.4) v1(85.2,76.2) v1(85.6,18.7) v1(86.4,73.1) v1(86.6,74.9) v1(87.2,76.1) v1(87.9,75.2) v1(88,37) v1(88,33) v1(88,29) v1(88,25) v1(88,21) v1(88,17) v1(88,13) v1(88,9) v1(88,5) v1(88,1) v1(89.8,76.5) v1(91,99) v1(91,1) v1(91.3,76.9) v1(95,1) v1(99,99) v1(99,95) v1(99,91) v1(99,87) v1(99,1)
V3_LDO: length 7.9
  Top Layer w0.5: V3_EN.1 89.17,62.1 C246.2 84.75,62.15 84.75,65.61
VCC: length 10.6
  Top Layer w0.15: 42.5,30.2 42.5,29.1
  Top Layer w0.5: v1(48.5,21.7) 5V.5 46.6,21.7 C81.2
  Top Layer w0.7: C220.2 C219.2 22.25,23.1 L17.2 21.9,25.67 21.87,25.7
  vias: v1(27.3,23.3) v1(27.3,22.5) v1(28.1,23.3) v1(28.1,22.5) v1(28.9,23.3) v1(28.9,22.5) v1(39.2,30.7) v1(39.2,30) v1(39.9,30.7) v1(39.9,30) v1(49.2,37.6) v1(49.2,36.9) v1(49.9,37.6) v1(49.9,36.9)
VDD_EN: length 36.5
  Top Layer w0.15: 52.5,35.9 52,35.9 51.8,36.1 v1(51.8,36.3) ; AVR.5 49.55,43.15 49.7,43 v1(50.6,43) ; U40.5 41,52.2 41.5,52.7 v1(41.8,52.7) ; v1(51.52,41.08) 57.68,41.08 VDD_EN.1 ; v1(46.4,48.2) 43.4,48.2 v1(42.2,49.4) 41.64,49.96 U40.1
  Bottom Layer w0.15: v1(46.4,48.2) 47.3,48.2 50.6,44.9 v1(50.6,43) 50.6,42 v1(51.52,41.08) 51.8,40.8 v1(51.8,36.3) ; v1(41.8,52.7) 41.8,49.8 v1(42.2,49.4)
ACCEL_INT: length 20.2
  Top Layer w0.15: U26.9 44.35,39.15 ; AVR.22 45.85,45.65 45.7,45.8 v1(45.4,45.8) ; R129.1 34,38.4 ACCEL_INT.1 42.1,38.4 42.9,39.2 44.4,39.2 v1(44.6,39.4)
  Bottom Layer w0.15: v1(45.4,45.8) 45.4,43.3 44.6,42.5 v1(44.6,39.4)
AUDIO_INT: length 64.3
  Top Layer w0.15: RP2350B.2 35.3,73.3 35.8,72.8 35.8,72.5 38.9,69.4 38.9,67 45.8,60.1 45.8,56.3 47.3,54.8 50.1,54.8 50.5,54.4 67.1,54.4 68.8,52.7 68.8,49 69.7,48.1 69.7,45.5 68.8,44.6 68.8,40.1 69.85,39.05 AUDIO.11
AUDIO_MICBIAS: length 12.6
  Top Layer w0.15: v1(75.2,33.5) 74.75,33.95 AUDIO.19 ; R103.2 68.4,30.2 69.5,31.3 v1(69.5,31.9) R123.2
  Bottom Layer w0.15: v1(69.5,31.9) 70.5,32.9 74.6,32.9 v1(75.2,33.5)
AUDIO_RESET: length 74.8
  Top Layer w0.15: RP2350B.8 36.6,75.7 37.2,75.1 39.3,75.1 41.9,72.5 41.9,68.45 48.95,61.4 49.6,61.4 51.41,59.59 51.41,57.99 52,57.4 69.1,57.4 75.5,51 81.4,51 82.2,50.2 ARESET.1 82.2,43.3 80.8,41.9 79.3,41.9 78.8,41.4 78.8,39.9 78.45,39.55 AUDIO.31
AVR_INT: length 43.9
  Top Layer w0.15: AVR.20 46.15,46.65 45.8,47 44,47 43.9,46.9 v1(42.2,46.9) 41.5,46.2 39.2,46.2 AVR_INT.1 ; v1(37.6,68.9) 34.71,71.79 RP2350B.80
  Bottom Layer w0.15: v1(37.6,68.9) 38.5,68 38.5,54.85 39.4,53.95 39.4,49.7 v1(42.2,46.9)
AVR_TX: length 57.5
  Top Layer w0.15: AVR.24 43.15,44.65 42.8,45 36.6,45 v1(26.9,54.7)
  Bottom Layer w0.15: v1(26.9,54.7) 23.92,54.7 4.22,74.4 1.6,74.4
BTN_1: length 47.7
  Top Layer w0.15: D17.2 D9.2 60.3,49 v1(58.7,47.4) 58.45,47.15 50.82,47.15
  Top Layer w0.2: v1(51.7,17.3) 50.8,16.4 D5.2
  Bottom Layer w0.15: v1(58.7,47.4) 53.7,42.4 53.7,19.3 v1(51.7,17.3)
BTN_2: length 49.3
  Top Layer w0.15: D10.2 D14.2 61.18,45.65 50.82,45.65
  Top Layer w0.2: v1(50,16.7) 49.3,16.7 49.1,16.5 D6.2
  Bottom Layer w0.15: v1(50,16.7) 53.4,16.7 54.9,18.2 54.9,41.8 58.8,45.7 v1(59.7,45.7)
BTN_3: length 52.3
  Top Layer w0.15: D11.2 52.5,15.6 51.6,14.7 48.3,14.7 47.4,15.6 D7.2 ; 50.82,46.15 59.15,46.15 v1(60.3,47.3) D15.2
  Top Layer w0.2: 52.5,15.93 53.8,17.23 v1(53.8,18.2)
  Bottom Layer w0.15: v1(53.8,18.2) 54.3,18.7 54.3,42.1 59.5,47.3 v1(60.3,47.3)
BTN_4: length 38.8
  Top Layer w0.15: AVR.6 50.62,43.87 v1(52.7,41.8)
  Top Layer w0.2: D12.2 44,16.6 44.3,16.9 v1(44.8,16.9) 45.4,16.9 45.7,16.6 D8.2
  Bottom Layer w0.15: v1(52.7,41.8) 53.1,41.4 53.1,19.6 51.1,17.6 45.5,17.6 v1(44.8,16.9)
BTN_ABXY: length 237.5
  Top Layer w0.15: 50.82,45.15 58.75,45.15 59.1,44.8 v1(60.1,44.8) ; 96.2,23.3 97.1,24.2 97.1,39 96.3,39.8 ; 96.2,23.3 89.3,23.3 ; 96.2,23.3 97.8,21.7 97.8,4 97.3,3.5 96.4,3.5 ; v1(96.3,40.8) 96.3,39.8 ; 96.3,39.8 89.2,39.8 ; 96.5,3.6 90.6,3.6 90.5,3.5 ; v1(39.3,24.3) 35.2,28.4 v1(35.2,29.3) ; 2.5,4.4 3.8,4.4 v1(4.9,5.5) 6,4.4 8.5,4.4
  Bottom Layer w0.15: v1(39.3,24.3) 40.8,22.8 40.8,19.5 44.7,15.6 54,15.6 v1(54.8,16.4) 55.5,17.1 55.5,41.5 58.8,44.8 v1(60.1,44.8) 63.9,44.8 65.3,46.2 70.6,46.2 72.9,43.9 82.6,43.9 84.8,41.7 95.4,41.7 v1(96.3,40.8) ; v1(35.2,29.3) 26.6,37.9 10.6,37.9 4.9,32.2 v1(4.9,5.5)
BTN_CTRL: length 79.6
  Top Layer w0.15: 92.5,64.7 92.5,66.8 ; 92.5,64.7 92.7,64.5 98.5,64.5 ; 92.5,64.7 92.5,64.4 ; 92.5,66.8 92.6,66.9 98.5,66.9 ; 92.5,66.8 92.5,67 ; 92.5,66.8 92.4,66.8 ; v1(89.2,64.5) 92.4,64.5 ; v1(83.2,58.3) 98.6,58.3 ; v1(62.4,48.1) 60.2,48.1 58.75,46.65 50.82,46.65
  Bottom Layer w0.15: v1(89.2,64.5) 88.7,64.5 83.2,59 v1(83.2,58.3) 82.4,58.3 72.2,48.1 v1(62.4,48.1)
BTN_DPAD: length 68.9
  Top Layer w0.15: AVR.19 46.45,47.15 46,47.6 41.8,47.6 v1(41.2,47) ; 18.3,36.6 v1(18.3,43.9) ; 15.7,34.2 15.6,34.1 8.3,34.1 7.2,35.2 7.2,43.9 8.3,45 v1(14.1,45) 15.6,45
  Bottom Layer w0.15: v1(14.1,45) 14.1,44.6 14.8,43.9 v1(18.3,43.9) 35.7,43.9 38.8,47 v1(41.2,47)
DB_0: length 79.6
  Top Layer w0.15: RP2350B.44 22.07,79.3 21.1,80.27 21.1,83.8 23,85.7 23,92.3 25.4,94.7 35.4,94.7 37.3,92.8 46.3,92.8 58.6,80.5 59.57,80.5 DISPLAY.24 62.75,80.45 68.1,85.8 74.41,85.8 H2.3
DB_1: length 74.8
  Top Layer w0.15: RP2350B.43 22.23,79.7 21.5,80.43 21.5,83.4 23.6,85.5 23.6,92.1 25.8,94.3 35,94.3 37.1,92.2 46.1,92.2 58.35,79.95 DISPLAY.23 63.15,79.95 67.8,84.6 73.15,84.6 H1.9
DB_2: length 76.1
  Top Layer w0.15: H2.4 74.45,83.3 67.4,83.3 63.55,79.45 DISPLAY.22 58.05,79.45 45.9,91.6 36.9,91.6 34.6,93.9 26.2,93.9 24.2,91.9 24.2,85.3 21.9,83 21.9,80.6 22.4,80.1 RP2350B.42
DB_3: length 67.1
  Top Layer w0.15: H1.8 73.19,82 67,82 63.95,78.95 DISPLAY.21 57.75,78.95 45.7,91 36.7,91 34.2,93.5 26.6,93.5 24.8,91.7 24.8,83.5 26.2,82.1 RP2350B.40
DB_4: length 68.9
  Top Layer w0.15: RP2350B.39 26.6,82.27 25.4,83.47 25.4,91.5 27,93.1 33.8,93.1 36.5,90.4 45.5,90.4 57.45,78.45 DISPLAY.20 64.35,78.45 66.6,80.7 74.39,80.7 H2.5
DB_5: length 64.7
  Top Layer w0.15: H1.7 73.17,79.5 66.3,79.5 64.75,77.95 DISPLAY.19 57.15,77.95 45.3,89.8 36.3,89.8 33.4,92.7 27.4,92.7 26,91.3 26,83.43 27,82.43 RP2350B.38
DB_6: length 66.4
  Top Layer w0.15: RP2350B.37 27.4,82.6 26.6,83.4 26.6,91.1 27.8,92.3 33,92.3 36.1,89.2 45.1,89.2 56.85,77.45 DISPLAY.18 65.25,77.45 66,78.2 74.43,78.2 H2.6
DB_7: length 62.2
  Top Layer w0.15: RP2350B.36 27.8,82.76 27.2,83.36 27.2,90.9 28.2,91.9 32.6,91.9 36,88.5 45,88.5 56.55,76.95 DISPLAY.17 73.18,76.95 H1.6
DB_8: length 54.2
  Top Layer w0.15: H2.7 74.47,75.7 69.4,75.7 68.65,76.45 DISPLAY.16 56.25,76.45 44.9,87.8 34.8,87.8 32.1,85.1 32.1,84.5 31,83.4 RP2350B.28
DB_9: length 50.7
  Top Layer w0.15: RP2350B.27 31.4,83.2 32.5,84.3 32.5,84.9 34.8,87.2 44.7,87.2 55.95,75.95 DISPLAY.15 68.25,75.95 69.8,74.4 73.19,74.4 H1.5
DB_10: length 53.2
  Top Layer w0.15: RP2350B.26 31.8,83 32.9,84.1 32.9,84.73 34.77,86.6 44.5,86.6 55.65,75.45 DISPLAY.14 67.85,75.45 70.1,73.2 74.51,73.2 H2.8
DB_11: length 49.8
  Top Layer w0.15: RP2350B.25 32.2,82.8 33.3,83.9 33.3,84.57 34.73,86 44.3,86 55.35,74.95 DISPLAY.13 67.45,74.95 70.6,71.8 73.15,71.8 H1.4
DB_12: length 51.4
  Top Layer w0.15: H2.9 74.45,70.6 70.9,70.6 67.05,74.45 DISPLAY.12 55.05,74.45 44.1,85.4 38.32,85.4 36.22,83.3 33.9,83.3 33,82.4 RP2350B.23
DB_13: length 47.9
  Top Layer w0.15: RP2350B.22 33.4,82.2 34.1,82.9 36.39,82.9 38.29,84.8 43.9,84.8 54.75,73.95 DISPLAY.11 66.65,73.95 71.29,69.31 H1.3
DB_14: length 50.5
  Top Layer w0.15: RP2350B.21 33.8,82 34.3,82.5 36.55,82.5 38.25,84.2 43.7,84.2 54.45,73.45 DISPLAY.10 66.25,73.45 71.7,68 74.39,68 H2.10
DB_15: length 46.5
  Top Layer w0.15: RP2350B.20 35.4,80.5 38.4,83.5 43.6,83.5 54.15,72.95 DISPLAY.9 65.85,72.95 72.03,66.77 H1.2
DISP_CSX: length 85
  Top Layer w0.15: RP2350B.48 21.17,77.7 19.5,79.37 19.5,85.4 20.6,86.5 20.6,93.1 23.8,96.3 37,96.3 38.1,95.2 47.1,95.2 57.85,84.45 DISPLAY.32 63.15,84.45 69.5,90.8 74.33,90.8 H2.1
DISP_DCX: length 80.2
  Top Layer w0.15: RP2350B.47 21.33,78.1 19.9,79.53 19.9,85 21.2,86.3 21.2,92.9 24.2,95.9 36.6,95.9 37.9,94.6 46.9,94.6 57.55,83.95 DISPLAY.31 63.55,83.95 69.23,89.63 H1.11
DISP_LED_K: length 23
  Top Layer w0.3: DISPLAY.6 62.22,71.45 ; 62.22,71.45 62.27,71.5 61.82,71.95 DISPLAY.7 ; 62.22,71.45 61.72,70.95 DISPLAY.5
  Top Layer w0.5: R84.1 v1(62.3,70)
  Bottom Layer w0.5: v1(62.3,70) 68.07,64.23 H1.1
DISP_RDX: length 76.7
  Top Layer w0.15: H1.10 73.19,87.1 68.5,87.1 64.35,82.95 DISPLAY.29 56.95,82.95 46.5,93.4 37.5,93.4 35.8,95.1 25,95.1 22.4,92.5 22.4,85.9 20.7,84.2 20.7,80 21.8,78.9 RP2350B.45
DISP_TE: length 83.7
  Top Layer w0.15: RP2350B.49 21,77.3 19.1,79.2 19.1,85.8 20,86.7 20,93.3 23.4,96.7 37.4,96.7 38.3,95.8 47.3,95.8 58.15,84.95 DISPLAY.33 62.75,84.95 69.97,92.17 H1.12
DISP_WRX: length 81.5
  Top Layer w0.15: H2.2 74.37,88.3 68.8,88.3 63.95,83.45 DISPLAY.30 57.25,83.45 46.7,94 37.7,94 36.2,95.5 24.6,95.5 21.8,92.7 21.8,86.1 20.3,84.6 20.3,79.7 21.5,78.5 RP2350B.46
EMBEDDED_ANTENNA: length 9.7
  Top Layer w0.15: L19.1 82.2,2.83 82.2,2 81.66,1.45 FMA.1 78.75,1.45 78,0.7 76,0.7 75.32,1.38 RADIO.4
GPIO_11: length 53.8
  Top Layer w0.15: RP2350B.9 36.8,76.1 37.1,75.8 41,75.8 41.2,75.6 arc(41.29,75.39) 41.2,75.18 40.87,74.85 arc(40.87,74.43) 41.3,74.43 41.62,74.75 arc(42.05,74.75) 42.05,74.33 41.72,74 arc(41.72,73.58) 42.15,73.58 42.47,73.9 arc(42.9,73.9) 42.9,73.48 42.57,73.15 arc(42.57,72.73) 43,72.73 43.32,73.05 arc(43.53,73.14) 43.75,73.05 43.9,72.9 43.9,72.5 arc(43.81,72.29) 43.6,72.2 42.8,72.2 arc(42.5,71.9) 42.8,71.6 43.7,71.6 arc(44,71.3) 43.7,71 42.8,71 arc(42.5,70.7) 42.8,70.4 43.7,70.4 arc(44,70.1) 43.7,69.8 42.8,69.8 arc(42.5,69.5) 42.8,69.2 43.7,69.2 arc(44,68.9) 43.7,68.6 43.4,68.6 arc(43.1,68.3) 43.4,68 43.6,68 arc(43.81,67.91) 43.9,67.7 43.9,67.4 49.3,62 50.15,62 arc(50.36,61.91) 50.45,61.7 50.45,61.5 arc(50.75,61.2) 51.05,61.5 51.05,61.7 arc(51.14,61.91) 51.35,62 51.68,62 51.95,61.74 arc(52.03,61.52) 51.95,61.31 51.48,60.85 arc(51.48,60.42) 51.9,60.42 53.17,61.69 arc(53.59,61.69) 53.59,61.26 52.68,60.35 arc(52.68,59.92) 53.1,59.92 54.12,60.94 arc(54.54,60.94) 54.54,60.52 53.53,59.5 arc(53.53,59.07) 53.95,59.07 54.07,59.19 arc(54.28,59.28) 54.49,59.19 CARTRIDGE.9
GPIO_12: length 53.8
  Top Layer w0.15: RP2350B.11 42.2,76.9 42.5,76.6 arc(42.59,76.39) 42.5,76.18 42.22,75.9 arc(42.22,75.48) 42.65,75.48 42.92,75.75 arc(43.35,75.75) 43.35,75.33 43.07,75.05 arc(43.07,74.63) 43.5,74.63 43.77,74.9 arc(44.2,74.9) 44.2,74.48 43.92,74.2 arc(43.92,73.78) 44.35,73.78 44.62,74.05 arc(44.83,74.14) 45.05,74.05 45.8,73.3 45.8,72.7 arc(45.71,72.49) 45.5,72.4 44.9,72.4 arc(44.6,72.1) 44.9,71.8 45.5,71.8 arc(45.8,71.5) 45.5,71.2 44.9,71.2 arc(44.6,70.9) 44.9,70.6 45.5,70.6 arc(45.8,70.3) 45.5,70 44.9,70 arc(44.6,69.7) 44.9,69.4 45.5,69.4 arc(45.8,69.1) 45.5,68.8 45,68.8 arc(44.7,68.5) 45,68.2 45.5,68.2 arc(45.8,67.9) 45.5,67.6 45.2,67.6 arc(44.9,67.3) 45.2,67 45.5,67 arc(45.71,66.91) 45.8,66.7 45.8,66.4 49.7,62.5 53.72,62.5 54.47,61.76 arc(54.68,61.67) 54.89,61.76 55.3,62.17 arc(55.73,62.17) 55.73,61.75 55.31,61.33 arc(55.31,60.91) 55.74,60.91 56.15,61.32 arc(56.58,61.32) 56.58,60.9 55.81,60.13 arc(55.81,59.71) 56.24,59.71 57,60.47 arc(57.43,60.47) 57.43,60.05 57.01,59.64 arc(56.92,59.42) 57.01,59.21 CARTRIDGE.8
GPIO_13: length 53.8
  Top Layer w0.15: CARTRIDGE.7 59.53,59.23 arc(59.44,59.44) 59.53,59.66 59.88,60 arc(59.88,60.42) 59.45,60.42 58.76,59.73 arc(58.33,59.73) 58.33,60.15 59.03,60.85 arc(59.03,61.27) 58.6,61.27 58.26,60.93 arc(57.83,60.93) 57.83,61.35 58.18,61.7 arc(58.18,62.12) 57.75,62.12 57.41,61.78 arc(56.99,61.78) 56.99,62.2 57.33,62.55 arc(57.33,62.97) 56.91,62.97 56.56,62.63 arc(56.35,62.54) 56.14,62.63 55.76,63 50.1,63 47.7,65.4 47.7,65.9 arc(47.61,66.11) 47.4,66.2 47,66.2 arc(46.7,66.5) 47,66.8 47.4,66.8 arc(47.7,67.1) 47.4,67.4 46.8,67.4 arc(46.5,67.7) 46.8,68 47.4,68 arc(47.7,68.3) 47.4,68.6 46.8,68.6 arc(46.5,68.9) 46.8,69.2 47.4,69.2 arc(47.7,69.5) 47.4,69.8 46.8,69.8 arc(46.5,70.1) 46.8,70.4 47.4,70.4 arc(47.7,70.7) 47.4,71 46.8,71 arc(46.5,71.3) 46.8,71.6 47.4,71.6 arc(47.61,71.69) 47.7,71.9 47.7,72.3 42.4,77.6 41.8,77.6 41.5,77.3 RP2350B.12
GPIO_14: length 53.8
  Top Layer w0.15: CARTRIDGE.6 62.1,59.2 arc(62.01,59.41) 62.1,59.63 62.48,60 arc(62.48,60.42) 62.05,60.42 61.48,59.85 arc(61.05,59.85) 61.05,60.27 61.63,60.85 arc(61.63,61.27) 61.2,61.27 60.83,60.9 arc(60.4,60.9) 60.4,61.32 60.78,61.7 arc(60.78,62.12) 60.35,62.12 59.98,61.75 arc(59.56,61.75) 59.56,62.17 59.93,62.55 arc(59.93,62.97) 59.51,62.97 59.13,62.6 arc(58.71,62.6) 58.71,63.02 58.73,63.04 arc(58.73,63.47) 58.31,63.47 58.28,63.44 arc(58.07,63.36) 57.86,63.44 57.8,63.5 50.5,63.5 49.2,64.8 49.2,65.4 arc(49.11,65.61) 48.9,65.7 48.7,65.7 arc(48.4,66) 48.7,66.3 48.9,66.3 arc(49.2,66.6) 48.9,66.9 48.7,66.9 arc(48.4,67.2) 48.7,67.5 48.9,67.5 arc(49.2,67.8) 48.9,68.1 48.7,68.1 arc(48.4,68.4) 48.7,68.7 48.9,68.7 arc(49.2,69) 48.9,69.3 48.7,69.3 arc(48.4,69.6) 48.7,69.9 48.9,69.9 arc(49.2,70.2) 48.9,70.5 48.7,70.5 arc(48.4,70.8) 48.7,71.1 48.9,71.1 arc(49.11,71.19) 49.2,71.4 49.2,71.7 42.6,78.3 41.6,78.3 41,77.7 RP2350B.13
GPIO_15: length 53.8
  Top Layer w0.15: CARTRIDGE.5 64.62,59.22 arc(64.53,59.43) 64.62,59.65 65.03,60.05 arc(65.03,60.47) 64.6,60.47 64.2,60.07 arc(63.77,60.07) 63.77,60.49 64.18,60.9 arc(64.18,61.32) 63.75,61.32 63.35,60.92 arc(62.92,60.92) 62.92,61.34 63.33,61.75 arc(63.33,62.17) 62.9,62.17 62.5,61.77 arc(62.08,61.77) 62.08,62.19 62.48,62.6 arc(62.48,63.02) 62.06,63.02 61.65,62.62 arc(61.23,62.62) 61.23,63.04 61.63,63.44 arc(61.63,63.87) 61.21,63.87 60.8,63.46 arc(60.59,63.38) 60.38,63.46 59.84,64 51.1,64 50.2,64.9 50.2,65.7 arc(50.16,65.8) 50.05,65.85 arc(49.94,65.89) 49.9,66 49.9,66.3 arc(49.94,66.4) 50.05,66.45 arc(50.16,66.49) 50.2,66.6 50.2,66.9 arc(50.16,67) 50.05,67.05 arc(49.94,67.09) 49.9,67.2 49.9,67.5 arc(49.94,67.6) 50.05,67.65 arc(50.16,67.69) 50.2,67.8 50.2,68.1 arc(50.16,68.2) 50.05,68.25 arc(49.94,68.29) 49.9,68.4 49.9,68.7 arc(49.94,68.8) 50.05,68.85 arc(50.16,68.89) 50.2,69 50.2,69.3 arc(50.16,69.4) 50.05,69.45 arc(49.94,69.49) 49.9,69.6 49.9,69.9 arc(49.94,70) 50.05,70.05 arc(50.16,70.09) 50.2,70.2 50.2,70.5 arc(50.16,70.6) 50.05,70.65 arc(49.94,70.69) 49.9,70.8 49.9,71.1 arc(49.94,71.2) 50.05,71.25 arc(50.16,71.29) 50.2,71.4 50.2,71.6 42.8,79 41.4,79 40.5,78.1 RP2350B.14
GPIO_16: length 53.9
  Top Layer w0.15: RP2350B.16 36.8,78.9 37.6,79.7 43,79.7 50.9,71.8 50.9,66.5 52.9,64.5 61.88,64.5 62,64.38 arc(62.21,64.29) 62.42,64.38 arc(62.85,64.38) 62.85,63.96 arc(62.85,63.53) 63.27,63.53 63.61,63.87 arc(64.03,63.87) 64.03,63.44 63.7,63.11 arc(63.7,62.69) 64.12,62.69 64.46,63.02 arc(64.88,63.02) 64.88,62.6 64.55,62.26 arc(64.55,61.84) 64.97,61.84 65.3,62.17 arc(65.73,62.17) 65.73,61.75 65.39,61.41 arc(65.39,60.99) 65.82,60.99 66.15,61.32 arc(66.58,61.32) 66.58,60.9 66.24,60.56 arc(66.24,60.14) 66.67,60.14 67.05,60.52 arc(67.48,60.52) 67.48,60.1 67.09,59.72 arc(67,59.5) 67.09,59.29 CARTRIDGE.4
GPIO_17: length 53.6
  Top Layer w0.15: RP2350B.17 36.5,79.3 37.6,80.4 43.2,80.4 51.6,72 51.6,66.7 53.3,65 63.92,65 65.37,63.55 arc(65.58,63.47) 65.79,63.55 65.96,63.72 arc(66.38,63.72) 66.38,63.29 66.22,63.13 arc(66.22,62.71) 66.64,62.71 66.81,62.87 arc(67.23,62.87) 67.23,62.45 67.07,62.28 arc(67.07,61.86) 67.49,61.86 67.65,62.02 arc(68.08,62.02) 68.08,61.6 67.91,61.43 arc(67.91,61.01) 68.34,61.01 68.5,61.17 arc(68.93,61.17) 68.93,60.75 68.76,60.58 arc(68.76,60.16) 69.19,60.16 69.35,60.32 arc(69.78,60.32) 69.78,59.9 69.61,59.74 arc(69.52,59.52) 69.61,59.31 CARTRIDGE.3
GPIO_18: length 53.7
  Top Layer w0.15: RP2350B.18 36.2,79.7 37.6,81.1 43.4,81.1 52.3,72.2 52.3,66.9 53.7,65.5 65.96,65.5 70.16,61.3 arc(70.38,61.21) 70.59,61.3 70.83,61.54 arc(71.26,61.54) 71.26,61.12 71.01,60.87 arc(71.01,60.45) 71.44,60.45 71.73,60.74 arc(72.16,60.74) 72.16,60.32 71.86,60.02 arc(71.77,59.81) 71.86,59.6 CARTRIDGE.2
GPIO_19: length 53.8
  Top Layer w0.15: CARTRIDGE.1 75.1,58.7 67.8,66 54.1,66 53,67.1 53,72.4 43.6,81.8 37.6,81.8 35.9,80.1 RP2350B.19
GPIO_47: length 16.2
  Top Layer w0.15: v1(23.74,72.8) 23.74,72.84 24.6,73.7 RP2350B.58
  Bottom Layer w0.15: v1(23.74,72.8) 23.74,62.86 24.5,62.1 CARTRIDGE.21
HEADSET_ANTENNA: length 3.8
  Top Layer w0.15: RADIO.2 74.32,1.92 74.1,1.7 C242.2
HEADSET_DETECT: length 80.7
  Top Layer w0.15: v1(71.2,37.3) 70.2,37.3 69.5,36.6 R123.1 ; v1(75.8,26.9) 78.1,29.2 C207.2 ; v1(68.8,24.8) 61.7,24.8 v1(61.2,24.3) ; AUDIO.8 73.72,40.7 v1(72.3,40.7) ; 50,2.8 46.5,2.8 45.6,3.7 v1(45.6,11.3)
  Bottom Layer w0.15: v1(72.3,40.7) 71.2,39.6 v1(71.2,37.3) 72.6,35.9 75.3,35.9 75.8,35.4 75.8,31.7 ; v1(45.6,11.3) 48.1,13.8 57.9,13.8 61.2,17.1 v1(61.2,24.3) ; 75.74,31.7 75.8,31.7 ; 75.8,31.7 v1(75.8,26.9) 73.7,24.8 v1(68.8,24.8)
HEADSET_LEFT: length 28.8
  Top Layer w0.25: v1(68.1,23.2) 65.7,23.2 64.5,22 C199.2 ; v1(78.6,36) 78.05,36.55 AUDIO.25
  Bottom Layer w0.25: v1(78.6,36) 78.6,35 78,34.4 78,24.5 76.7,23.2 v1(68.1,23.2)
HEADSET_MIC: length 4.9
  Top Layer w0.15: C207.1 78.1,32.4 75.75,34.75 AUDIO.21
HEADSET_RIGHT: length 32.2
  Top Layer w0.25: v1(66.7,19.9) 65.7,18.9 C200.2 ; v1(78.8,37.5) 78.75,37.55 AUDIO.27
  Bottom Layer w0.25: v1(78.8,37.5) 79,37.5 79.9,36.6 79.9,24.4 77.2,21.7 68.5,21.7 v1(66.7,19.9)
I2C_SCL: length 66.5
  Top Layer w0.15: v1(42.4,50.4) 42.15,50.65 U40.2 ; I2C_SCL.1 38.16,43.6 R45.1 ; v1(47,50.2) 47.62,50.2 U41.4 47.95,50.25 48.55,49.65 48.55,47.92 ; v1(41.97,36.94) 42.92,36.94 U26.13 ; v1(27.7,16) 27.25,16.45 PWR.5 ; v1(44,44) v1(42.8,44) 42.4,43.6 38.9,43.6
  Bottom Layer w0.15: v1(42.4,50.4) 42.8,50 v1(42.8,44) 42.8,39.3 42,38.5 42,36.97 ; v1(44,44) 44,48.5 45.7,50.2 v1(47,50.2) ; v1(41.97,36.94) 42,36.97 ; 42,36.97 42,29.8 33.6,21.4 33.6,20.3 29.3,16 v1(27.7,16)
I2C_SCL_VDD: length 121.7
  Top Layer w0.15: RADIO.7 77.54,3.06 v1(77.7,2.9) ; 41,49.2 U40.10 ; AUDIO.9 71.85,40.05 v1(70.7,41.2) v1(69.8,40.3) ; RP2350B.78 33,70.9 33.4,70.5 34.1,70.5 36.8,67.8 36.8,66.5 41.1,62.2 41.1,56.1 v1(42,55.2) 43.1,54.1 45.3,54.1 46.4,53 49.2,53 49.6,52.6 66.2,52.6 67,51.8 v1(67,44.2)
  Bottom Layer w0.15: v1(67,44.2) 68.6,42.6 69.3,42.6 v1(70.7,41.2) ; v1(77.7,2.9) 77.5,2.7 72.8,2.7 67.4,8.1 67.4,11.2 63.1,15.5 63.1,33.6 v1(69.8,40.3) ; v1(42,55.2) 41.1,54.3 41.1,49.3 v1(41,49.2)
I2C_SDA: length 66.7
  Top Layer w0.15: U40.4 41.85,51.65 42.3,52.1 v1(42.4,52.1) ; 49.05,47.92 49.05,50.75 48.25,51.55 U41.6 47.62,51.5 v1(47,51.5) ; R46.1 38.15,40.9 I2C_SDA.1 38.31,41 v1(43.4,41) ; PWR.6 27.75,16.95 28.4,16.3 v1(28.4,15.4) ; U26.14 42.8,36.4 42.7,36.3 v1(42.7,35.6)
  Bottom Layer w0.15: v1(47,51.5) 43.8,51.5 43.4,51.1 ; 43.4,51.1 v1(43.4,41) 43.4,39 42.7,38.3 v1(42.7,35.6) 42.7,29.6 34.2,21.1 34.2,20 29.6,15.4 v1(28.4,15.4) ; 43.4,51.1 v1(42.4,52.1)
I2C_SDA_VDD: length 117.7
  Top Layer w0.15: 41.1,53.4 45.1,53.4 46.1,52.4 48.9,52.4 49.3,52 65.9,52 66.4,51.5 v1(66.4,43.5) ; 41.1,53.4 40.4,54.1 40.4,55.8 40.8,56.2 40.8,61.9 36.3,66.4 36.3,67.7 34,70 33.2,70 32.6,70.6 RP2350B.77 ; 41.1,53.4 40.36,52.66 U40.6 40.4,51.69 ; v1(78.2,3.8) 77.96,3.56 RADIO.8 ; v1(70.7,40.3) 71.45,39.55 AUDIO.10
  Bottom Layer w0.15: v1(78.2,3.8) 77.2,4.8 71.6,4.8 68.9,7.5 68.9,12.4 SDA_VDD.1 63.8,17.5 63.8,33.4 v1(70.7,40.3) 69,42 67.9,42 v1(66.4,43.5)
I2S_BCK: length 68
  Top Layer w0.15: RP2350B.7 36.4,75.3 37.2,74.5 39.2,74.5 41.3,72.4 41.3,68.2 48.7,60.8 49.3,60.8 50.9,59.2 50.9,57.6 51.7,56.8 68.7,56.8 75.2,50.3 78.4,50.3 79,49.7 BCK.1 79,43.9 76.75,41.65 AUDIO.2
I2S_DIN: length 60.6
  Top Layer w0.15: 75.75,40.85 75.75,47.85 DIN.1 ; 75.75,40.85 AUDIO.4 ; 75.75,40.85 75.7,40.9 ; 75.75,40.85 75.8,40.8 ; 75.1,48.4 67.9,55.6 51.1,55.6 50.7,56 49.8,56 48.4,57.4 48.4,59.3 40.1,67.6 40.1,69.8 35.8,74.1 RP2350B.4
I2S_DOUT: length 61.6
  Top Layer w0.15: RP2350B.3 35.7,73.7 36.3,73.1 36.3,72.8 39.5,69.6 39.5,67.3 46.3,60.5 46.3,56.7 47.6,55.4 50.4,55.4 50.8,55 67.5,55 74.2,48.3 DOUT.1 74.2,43.1 75.25,42.05 AUDIO.5
I2S_LRCK: length 65.6
  Top Layer w0.15: RP2350B.6 36.2,74.9 37.2,73.9 39.1,73.9 40.7,72.3 40.7,67.9 48.9,59.7 48.9,57.8 50.1,56.6 51,56.6 51.4,56.2 68.3,56.2 74.9,49.6 76.7,49.6 77.4,48.9 LRCK.1 77.4,43.2 76.25,42.05 AUDIO.3
IOVDD: length 153.6
  Top Layer w0.15: v1(35.6,56.2) QSPI_PULLUP.2 ; DISPLAY.34 61.55,85.45 v1(62.1,86) ; v1(70.8,43.3) 70.8,46.7 R131.2 ; 54.6,34.1 54.6,33 54.7,32.9 ; 82.85,68.19 82.85,69.35 83.36,69.86 84.75,69.86 ; 54.7,34.1 v1(56.3,34.1) ; v1(61.4,86.8) 60.55,85.95 DISPLAY.35
  Top Layer w0.2: 31,84.85 31,84.1 30.6,83.7 RP2350B.29 30.6,80 ; 29.2,69.4 29,69.6 RP2350B.68 29,73.1 ; 29.2,69.4 C167.2 ; 29.2,69.4 29.4,69.6 RP2350B.69 29.4,73.1 ; 34.16,84.2 34.16,84.15 32.6,82.6 RP2350B.24 32.6,80.1 ; C111.2 23.25,80.5 RP2350B.41 26,80.5 ; v1(23.3,68.4) 23.3,69.23 23.37,69.3 ; 33.5,74.5 RP2350B.5 36,74.5 37.2,73.3 37.9,73.3 38.21,72.99 ; C110.2 21.94,76.9 RP2350B.50 26.1,76.9 ; 32.2,73 RP2350B.76 32.2,70.3 33.1,69.4 33.4,69.4 C108.2 ; C112.2 37.6,78.9 37.2,78.5 RP2350B.15 33.6,78.5 ; 26.1,72.9 RP2350B.60 24.7,72.9 24.1,72.3 21.94,72.3 C116.2
  Top Layer w0.25: 76.5,6.85 76.5,6.84 76.5,6 76.32,5.82 RADIO.11 ; 76.5,6.85 76.52,6.88 v1(76.52,7.52) 76.52,8.1 ; 76.5,6.85 C236.2 76.44,6.9 76.5,6.85 ; RADIO.10 76.96,4.56 77.4,5 77.4,7.7 77,8.1 76.52,8.1 ; C192.2 C191.2 79.94,36.9 78.6,36.9 78.45,37.05 AUDIO.26 ; C192.2 v1(81,36) ; C192.2 C204.1 ; 76.44,8.1 C237.1 76.52,8.12 76.52,8.1 ; 76.44,8.1 76.25,8.1 ; 76.44,8.1 76.52,8.1 ; v1(73.1,41.5) 73.1,42.05 C209.2 74,42.3 74.75,41.55 AUDIO.6 ; AUDIO.30 78.85,39.05 v1(79.1,39.3)
  Top Layer w0.3: v1(57,71.5) 57.95,72.45 DISPLAY.8 ; AMP.6 81.97,17.77 81.75,17.55 C208.2 81.75,16.16 v1(81.7,16.1)
  Top Layer w0.5: v1(57.1,35.4) 59.23,35.4 IOVDD.1 ; 82.3,87.2 v1(82.3,88.4) 82.3,89.6 ; U42.1 84.75,71.55 C245.2 84.8,73 84.1,73.7 v1(78.1,73.7) ; v1(52.1,31.2) v1(52.1,30.5) 52.1,30 51.7,29.6 50.3,29.6 50.3,27.1 ; 85.1,89.7 C132.2
  Inner2 w0.5: 46.16,57.5 46.16,59.84 46,60 ; 46.16,57.5 45.86,57.2 ; 46.16,57.5 48.1,57.5 ; 45.86,57.2 48.2,57.2 ; 45.86,57.2 45.36,56.7 ; 44.86,56.2 45.36,56.7 ; 44.86,56.2 49.7,56.2 ; 44.86,56.2 v1(35.6,56.2) ; 45.36,56.7 48.5,56.7
  Inner2 w1.5: AVCC.3 85.7,49.4 84.3,50.8 78.1,50.8 ; AVCC.2 84.4,45.7 81.9,43.2 79.4,43.2
  vias: v1(33.8,80.4) v1(33.8,79.8) v1(33.8,79.2) v1(33.8,73.5) v1(33.8,72.9) v1(56.5,40.1) v1(56.5,39.4) v1(56.5,38.7) v1(57.2,40.1) v1(57.2,39.4) v1(57.2,38.7)
